# EAGLE board 4high (EAGLE 6.6.0), part 1 of 2
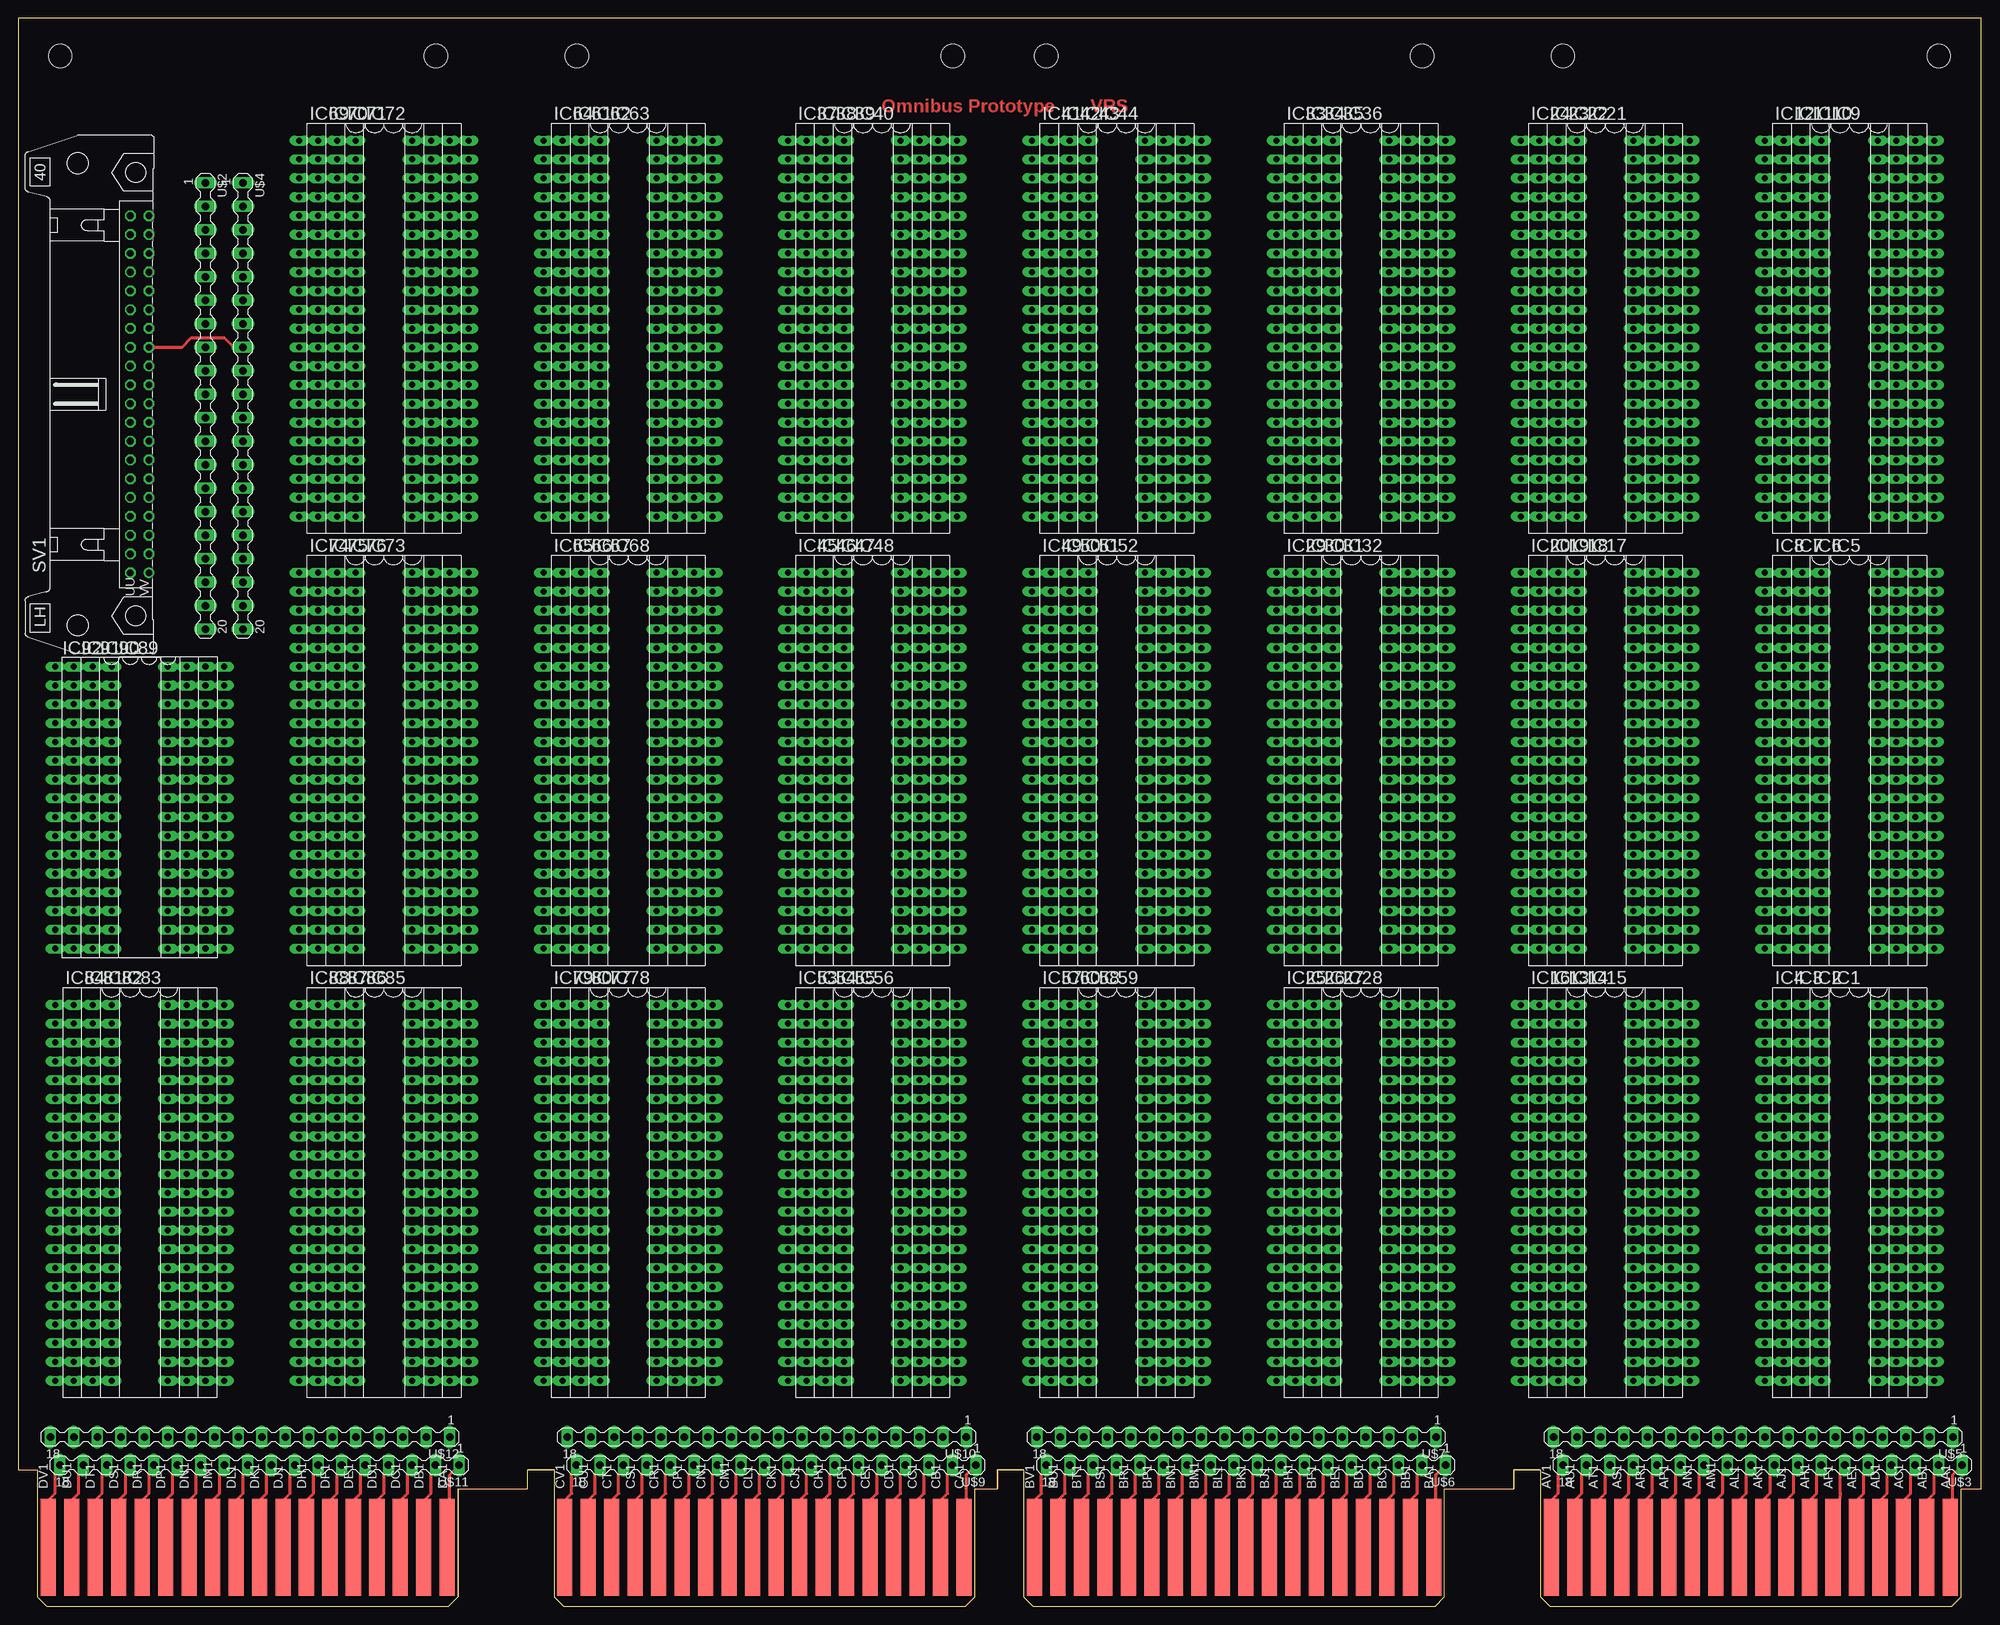
[diagram p1: board, top side]
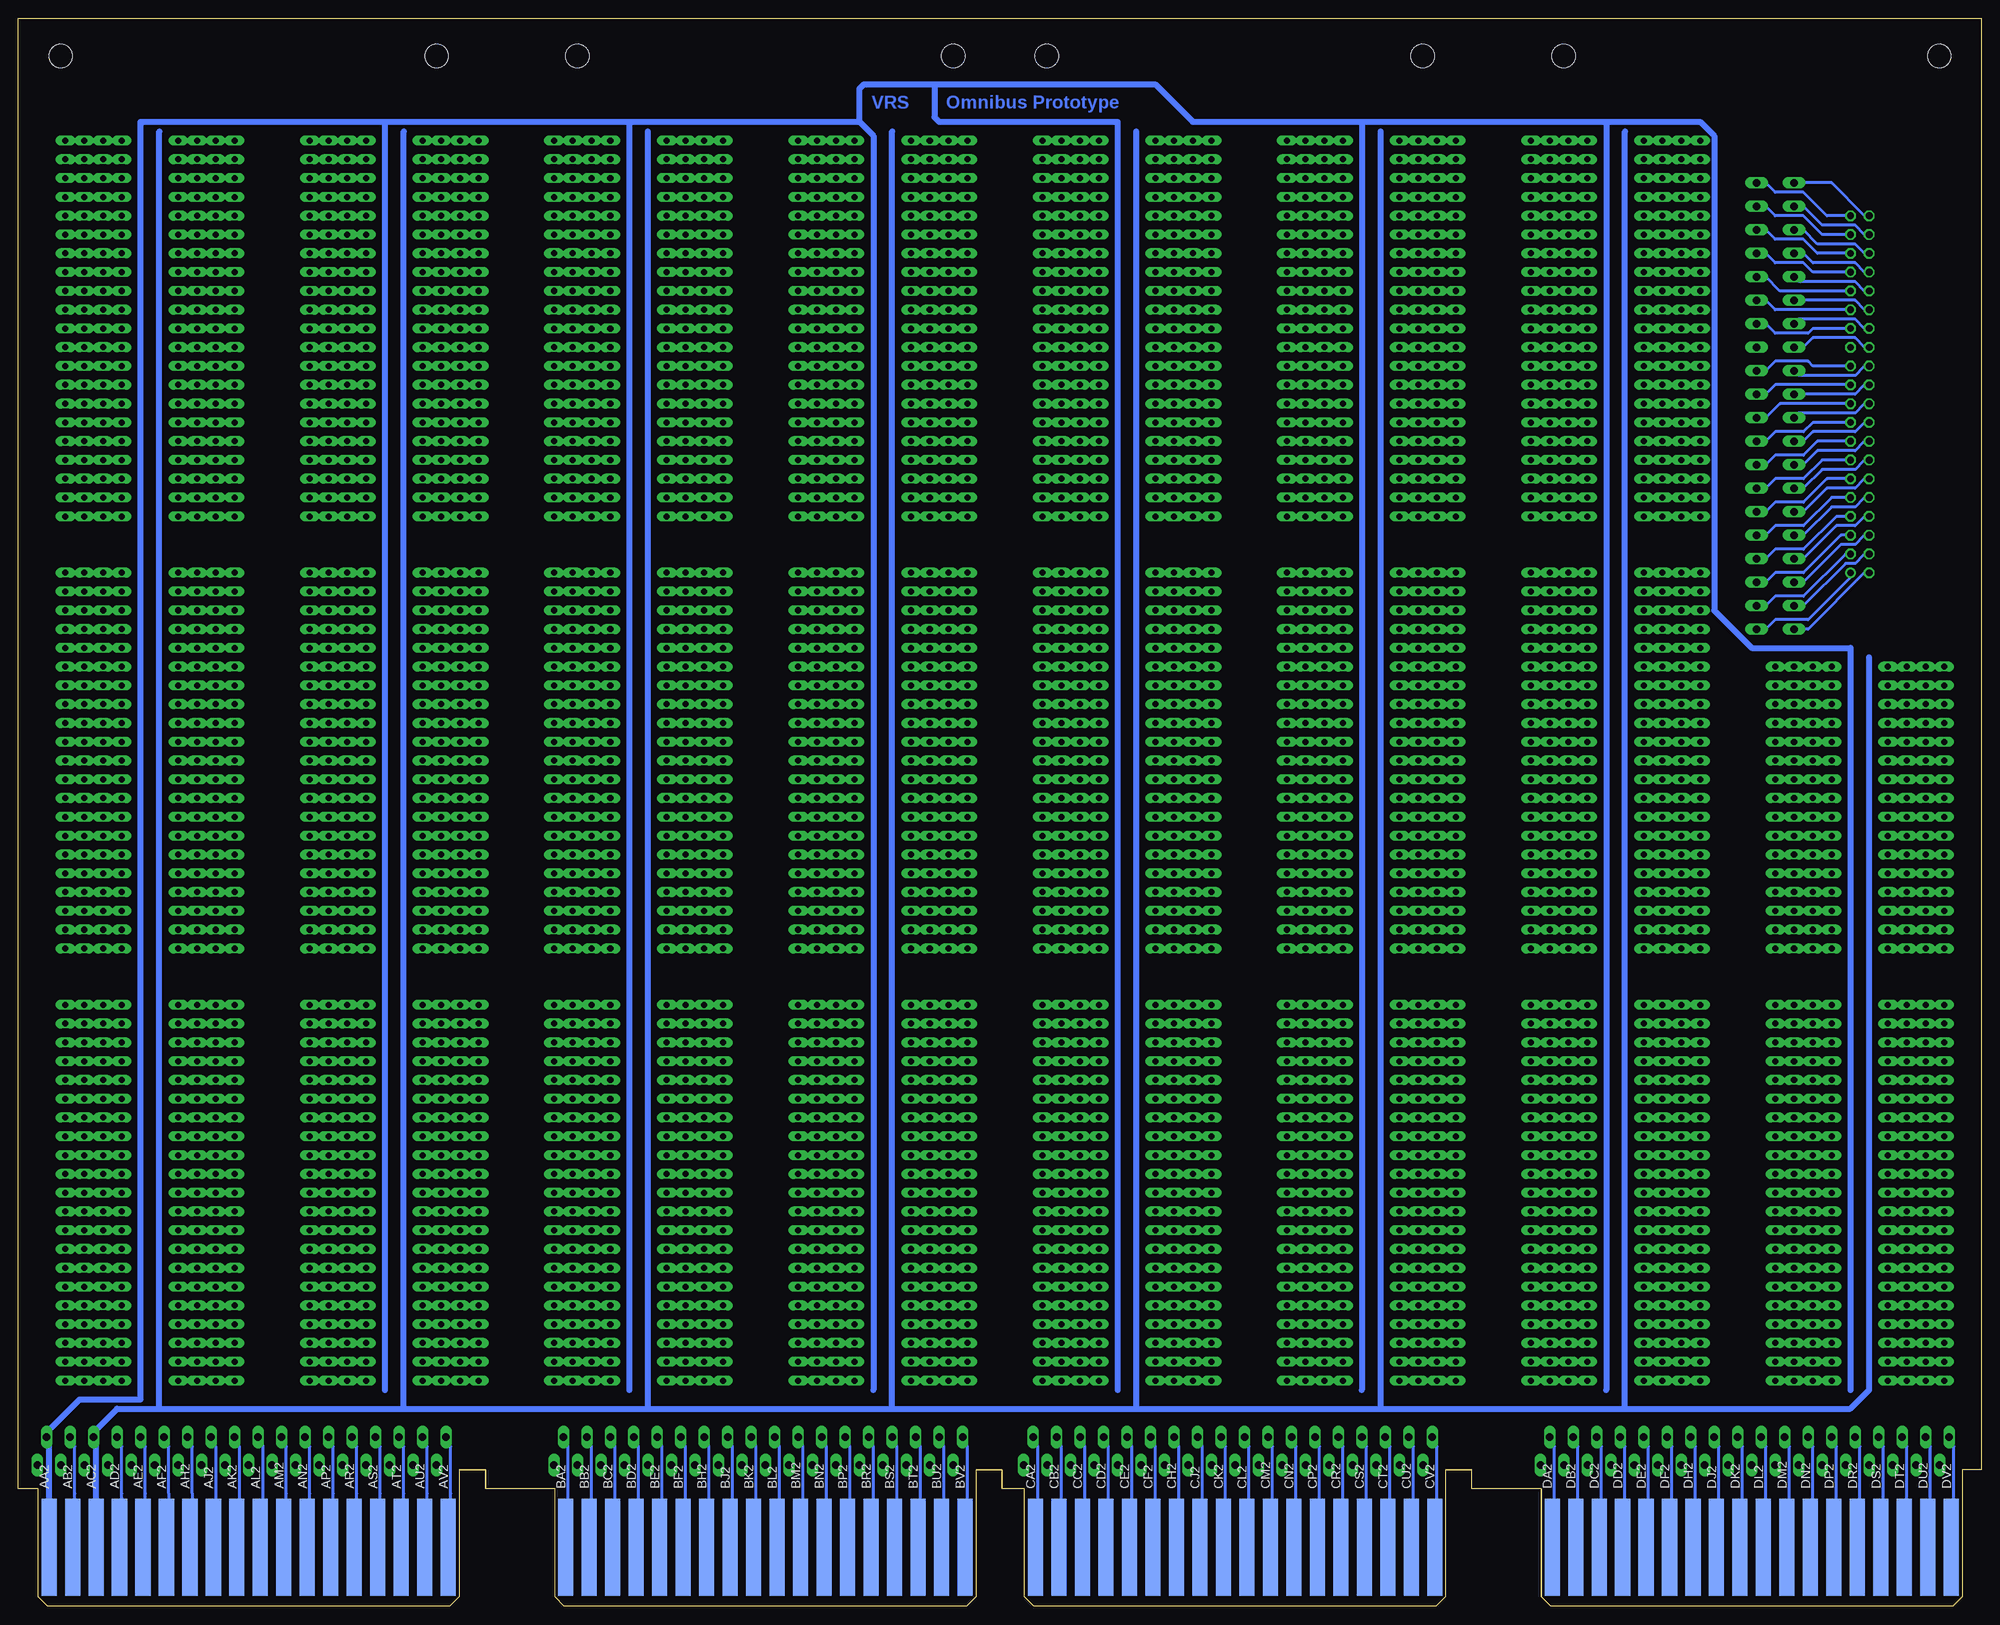
[diagram p2: board, bottom side, seen from below]

Size 265.3 x 214.63 mm. Coordinates in mm from the lower left corner, seen from the top.
Copper layers (1+16): Top 0.035mm / dielectric 1.5mm / Bottom 0.035mm
Design rules "16mils": minimum track width 16mil, minimum drill 32mil, track to track 15mil, track to pad 10mil, pad to pad 10mil, via to via 10mil, smd to smd 10mil, copper to edge 13mil, drill to drill 10mil, minimum pad ring 10mil, minimum via ring 8mil, stop-mask expansion 0mil, vias tented up to drill 0mil, thermal gap 10mil
Net classes: 1 supply: width 0.508 mm

## Footprints (pad centres in the part's own frame; a part is rotated, then mirrored left to right if it is on the bottom)
DIL42 = drill 0.813 long: 1 -25.4,-7.62; 2 -22.86,-7.62; 3 -20.32,-7.62; 4 -17.78,-7.62; 5 -15.24,-7.62; 6 -12.7,-7.62; 7 -10.16,-7.62; 8 -7.62,-7.62; 9 -5.08,-7.62; 10 -2.54,-7.62; 11 0,-7.62; 12 2.54,-7.62; 13 5.08,-7.62; 14 7.62,-7.62; 15 10.16,-7.62; 16 12.7,-7.62; 17 15.24,-7.62; 18 17.78,-7.62; 19 20.32,-7.62; 20 22.86,-7.62; 21 25.4,-7.62; 22 25.4,7.62; 23 22.86,7.62; 24 20.32,7.62; 25 17.78,7.62; 26 15.24,7.62; 27 12.7,7.62; 28 10.16,7.62; 29 7.62,7.62; 30 5.08,7.62; 31 2.54,7.62; 32 0,7.62; 33 -2.54,7.62; 34 -5.08,7.62; 35 -7.62,7.62; 36 -10.16,7.62; 37 -12.7,7.62; 38 -15.24,7.62; 39 -17.78,7.62; 40 -20.32,7.62; 41 -22.86,7.62; 42 -25.4,7.62
DIL32 = drill 0.813 long: 1 -19.05,-7.62; 2 -16.51,-7.62; 3 -13.97,-7.62; 4 -11.43,-7.62; 5 -8.89,-7.62; 6 -6.35,-7.62; 7 -3.81,-7.62; 8 -1.27,-7.62; 9 1.27,-7.62; 10 3.81,-7.62; 11 6.35,-7.62; 12 8.89,-7.62; 13 11.43,-7.62; 14 13.97,-7.62; 15 16.51,-7.62; 16 19.05,-7.62; 17 19.05,7.62; 18 16.51,7.62; 19 13.97,7.62; 20 11.43,7.62; 21 8.89,7.62; 22 6.35,7.62; 23 3.81,7.62; 24 1.27,7.62; 25 -1.27,7.62; 26 -3.81,7.62; 27 -6.35,7.62; 28 -8.89,7.62; 29 -11.43,7.62; 30 -13.97,7.62; 31 -16.51,7.62; 32 -19.05,7.62
DEC40PINH = drill 0.914 octagon: A 24.13,1.27; AA -3.81,1.27; B 24.13,-1.27; BB -3.81,-1.27; C 21.59,1.27; CC -6.35,1.27; D 21.59,-1.27; DD -6.35,-1.27; E 19.05,1.27; EE -8.89,1.27; F 19.05,-1.27; FF -8.89,-1.27; H 16.51,1.27; HH -11.43,1.27; J 16.51,-1.27; JJ -11.43,-1.27; K 13.97,1.27; KK -13.97,1.27; L 13.97,-1.27; LL -13.97,-1.27; M 11.43,1.27; MM -16.51,1.27; N 11.43,-1.27; NN -16.51,-1.27; P 8.89,1.27; PP -19.05,1.27; R 8.89,-1.27; RR -19.05,-1.27; S 6.35,1.27; SS -21.59,1.27; T 6.35,-1.27; TT -21.59,-1.27; U 3.81,1.27; UU -24.13,1.27; V 3.81,-1.27; W 1.27,1.27; X 1.27,-1.27; Y -1.27,1.27; Z -1.27,-1.27 | drill 0.914: VV -24.13,-1.27
EDGE-CON8 = smd 2.032 x 13.106: AA1 261.303,7.938; AB1 258.127,7.938; AC1 254.952,7.938; AD1 251.778,7.938; AE1 248.602,7.938; AF1 245.428,7.938; AH1 242.252,7.938; AJ1 239.077,7.938; AK1 235.903,7.938; AL1 232.727,7.938; AM1 229.553,7.938; AN1 226.377,7.938; AP1 223.202,7.938; AR1 220.028,7.938; AS1 216.852,7.938; AT1 213.678,7.938; AU1 210.502,7.938; AV1 207.327,7.938; BA1 191.452,7.938; BB1 188.278,7.938; BC1 185.102,7.938; BD1 181.928,7.938; BE1 178.752,7.938; BF1 175.577,7.938; BH1 172.403,7.938; BJ1 169.227,7.938; BK1 166.053,7.938; BL1 162.877,7.938; BM1 159.702,7.938; BN1 156.528,7.938; BP1 153.352,7.938; BR1 150.178,7.938; BS1 147.002,7.938; BT1 143.827,7.938; BU1 140.653,7.938; BV1 137.477,7.938; CA1 127.953,7.938; CB1 124.778,7.938; CC1 121.603,7.938; CD1 118.427,7.938; CE1 115.252,7.938; CF1 112.078,7.938; CH1 108.903,7.938; CJ1 105.728,7.938; CK1 102.552,7.938; CL1 99.377,7.938; CM1 96.203,7.938; CN1 93.028,7.938; CP1 89.853,7.938; CR1 86.677,7.938; CS1 83.502,7.938; CT1 80.328,7.938; CU1 77.153,7.938; CV1 73.978,7.938; DA1 58.102,7.938; DB1 54.928,7.938; DC1 51.752,7.938; DD1 48.578,7.938; DE1 45.403,7.938; DF1 42.227,7.938; DH1 39.053,7.938; DJ1 35.877,7.938; DK1 32.703,7.938; DL1 29.527,7.938; DM1 26.352,7.938; DN1 23.177,7.938; DP1 20.003,7.938; DR1 16.828,7.938; DS1 13.652,7.938; DT1 10.477,7.938; DU1 7.303,7.938; DV1 4.128,7.938 | smd 2.032 x 13.106 bottom: AA2 261.303,7.938; AB2 258.127,7.938; AC2 254.952,7.938; AD2 251.778,7.938; AE2 248.602,7.938; AF2 245.428,7.938; AH2 242.252,7.938; AJ2 239.077,7.938; AK2 235.903,7.938; AL2 232.727,7.938; AM2 229.553,7.938; AN2 226.377,7.938; AP2 223.202,7.938; AR2 220.028,7.938; AS2 216.852,7.938; AT2 213.678,7.938; AU2 210.502,7.938; AV2 207.327,7.938; BA2 191.452,7.938; BB2 188.278,7.938; BC2 185.102,7.938; BD2 181.928,7.938; BE2 178.752,7.938; BF2 175.577,7.938; BH2 172.403,7.938; BJ2 169.227,7.938; BK2 166.053,7.938; BL2 162.877,7.938; BM2 159.702,7.938; BN2 156.528,7.938; BP2 153.352,7.938; BR2 150.178,7.938; BS2 147.002,7.938; BT2 143.827,7.938; BU2 140.653,7.938; BV2 137.477,7.938; CA2 127.953,7.938; CB2 124.778,7.938; CC2 121.603,7.938; CD2 118.427,7.938; CE2 115.252,7.938; CF2 112.078,7.938; CH2 108.903,7.938; CJ2 105.728,7.938; CK2 102.552,7.938; CL2 99.377,7.938; CM2 96.203,7.938; CN2 93.028,7.938; CP2 89.853,7.938; CR2 86.677,7.938; CS2 83.502,7.938; CT2 80.328,7.938; CU2 77.153,7.938; CV2 73.978,7.938; DA2 58.102,7.938; DB2 54.928,7.938; DC2 51.752,7.938; DD2 48.578,7.938; DE2 45.403,7.938; DF2 42.227,7.938; DH2 39.053,7.938; DJ2 35.877,7.938; DK2 32.703,7.938; DL2 29.527,7.938; DM2 26.352,7.938; DN2 23.177,7.938; DP2 20.003,7.938; DR2 16.828,7.938; DS2 13.652,7.938; DT2 10.477,7.938; DU2 7.303,7.938; DV2 4.128,7.938
MA20-1 = drill 1.016 long: 1 -28.575,0; 2 -25.4,0; 3 -22.225,0; 4 -19.05,0; 5 -15.875,0; 6 -12.7,0; 7 -9.525,0; 8 -6.35,0; 9 -3.175,0; 10 0,0; 11 3.175,0; 12 6.35,0; 13 9.525,0; 14 12.7,0; 15 15.875,0; 16 19.05,0; 17 22.225,0; 18 25.4,0; 19 28.575,0; 20 31.75,0
MA18-1 = drill 1.016 long: 1 -25.4,0; 2 -22.225,0; 3 -19.05,0; 4 -15.875,0; 5 -12.7,0; 6 -9.525,0; 7 -6.35,0; 8 -3.175,0; 9 0,0; 10 3.175,0; 11 6.35,0; 12 9.525,0; 13 12.7,0; 14 15.875,0; 15 19.05,0; 16 22.225,0; 17 25.4,0; 18 28.575,0
OMNIBUS = hole 3.175: 208.915,209.55; 259.715,209.55; 189.865,209.55; 139.065,209.55; 75.616,209.55; 126.416,209.55; 56.566,209.55; 5.766,209.55

## Placement (x,y rotation side)
IC1  [DIL42]  251.33,55.88 270 top
IC2  [DIL42]  248.79,55.88 270 top
IC3  [DIL42]  246.25,55.88 270 top
IC4  [DIL42]  243.71,55.88 270 top
IC5  [DIL42]  251.33,114.3 270 top
IC6  [DIL42]  248.79,114.3 270 top
IC7  [DIL42]  246.25,114.3 270 top
IC8  [DIL42]  243.71,114.3 270 top
IC9  [DIL42]  251.33,172.72 270 top
IC10  [DIL42]  248.79,172.72 270 top
IC11  [DIL42]  246.25,172.72 270 top
IC12  [DIL42]  243.71,172.72 270 top
IC13  [DIL42]  213.23,55.88 270 top
IC14  [DIL42]  215.77,55.88 270 top
IC15  [DIL42]  218.31,55.88 270 top
IC16  [DIL42]  210.69,55.88 270 top
IC17  [DIL42]  218.31,114.3 270 top
IC18  [DIL42]  215.77,114.3 270 top
IC19  [DIL42]  213.23,114.3 270 top
IC20  [DIL42]  210.69,114.3 270 top
IC21  [DIL42]  218.31,172.72 270 top
IC22  [DIL42]  215.77,172.72 270 top
IC23  [DIL42]  213.23,172.72 270 top
IC24  [DIL42]  210.69,172.72 270 top
IC25  [DIL42]  177.67,55.88 270 top
IC26  [DIL42]  180.21,55.88 270 top
IC27  [DIL42]  182.75,55.88 270 top
IC28  [DIL42]  185.29,55.88 270 top
IC29  [DIL42]  177.67,114.3 270 top
IC30  [DIL42]  180.21,114.3 270 top
IC31  [DIL42]  182.75,114.3 270 top
IC32  [DIL42]  185.29,114.3 270 top
IC33  [DIL42]  177.67,172.72 270 top
IC34  [DIL42]  180.21,172.72 270 top
IC35  [DIL42]  182.75,172.72 270 top
IC36  [DIL42]  185.29,172.72 270 top
IC37  [DIL42]  111.63,172.72 270 top
IC38  [DIL42]  114.17,172.72 270 top
IC39  [DIL42]  116.71,172.72 270 top
IC40  [DIL42]  119.25,172.72 270 top
IC41  [DIL42]  144.65,172.72 270 top
IC42  [DIL42]  147.19,172.72 270 top
IC43  [DIL42]  149.73,172.72 270 top
IC44  [DIL42]  152.27,172.72 270 top
IC45  [DIL42]  111.63,114.3 270 top
IC46  [DIL42]  114.17,114.3 270 top
IC47  [DIL42]  116.71,114.3 270 top
IC48  [DIL42]  119.25,114.3 270 top
IC49  [DIL42]  144.65,114.3 270 top
IC50  [DIL42]  147.19,114.3 270 top
IC51  [DIL42]  149.73,114.3 270 top
IC52  [DIL42]  152.27,114.3 270 top
IC53  [DIL42]  111.63,55.88 270 top
IC54  [DIL42]  114.17,55.88 270 top
IC55  [DIL42]  116.71,55.88 270 top
IC56  [DIL42]  119.25,55.88 270 top
IC57  [DIL42]  144.65,55.88 270 top
IC58  [DIL42]  149.73,55.88 270 top
IC59  [DIL42]  152.27,55.88 270 top
IC60  [DIL42]  147.19,55.88 270 top
IC61  [DIL42]  81.15,172.72 270 top
IC62  [DIL42]  83.69,172.72 270 top
IC63  [DIL42]  86.23,172.72 270 top
IC64  [DIL42]  78.61,172.72 270 top
IC65  [DIL42]  78.61,114.3 270 top
IC66  [DIL42]  81.15,114.3 270 top
IC67  [DIL42]  83.69,114.3 270 top
IC68  [DIL42]  86.23,114.3 270 top
IC69  [DIL42]  45.59,172.72 270 top
IC70  [DIL42]  48.13,172.72 270 top
IC71  [DIL42]  50.67,172.72 270 top
IC72  [DIL42]  53.21,172.72 270 top
IC73  [DIL42]  53.21,114.3 270 top
IC74  [DIL42]  45.59,114.3 270 top
IC75  [DIL42]  48.13,114.3 270 top
IC76  [DIL42]  50.67,114.3 270 top
IC77  [DIL42]  83.69,55.88 270 top
IC78  [DIL42]  86.23,55.88 270 top
IC79  [DIL42]  78.61,55.88 270 top
IC80  [DIL42]  81.15,55.88 270 top
IC81  [DIL42]  15.11,55.88 270 top
IC82  [DIL42]  17.65,55.88 270 top
IC83  [DIL42]  20.19,55.88 270 top
IC84  [DIL42]  12.57,55.88 270 top
IC85  [DIL42]  53.21,55.88 270 top
IC86  [DIL42]  50.67,55.88 270 top
IC87  [DIL42]  48.13,55.88 270 top
IC88  [DIL42]  45.59,55.88 270 top
IC89  [DIL32]  20.19,107.95 270 top
IC90  [DIL32]  17.65,107.95 270 top
IC91  [DIL32]  15.11,107.95 270 top
IC92  [DIL32]  12.57,107.95 270 top
SV1  [DEC40PINH]  16.38,163.83 90 top
U$1  [EDGE-CON8]  -0.13,0 0 top
U$2  MA20-1  [MA20-1]  25.27,163.83 270 top
U$3  MA18-1  [MA18-1]  237.36,19.05 180 top
U$4  MA20-1  [MA20-1]  30.35,163.83 270 top
U$5  MA18-1  [MA18-1]  236.09,22.86 180 top
U$6  MA18-1  [MA18-1]  167.51,19.05 180 top
U$7  MA18-1  [MA18-1]  166.24,22.86 180 top
U$8  OUTLINE-OMNIBUS  [OMNIBUS]  -0.13,0 0 top
U$9  MA18-1  [MA18-1]  104.01,19.05 180 top
U$10  MA18-1  [MA18-1]  102.74,22.86 180 top
U$11  MA18-1  [MA18-1]  34.16,19.05 180 top
U$12  MA18-1  [MA18-1]  32.89,22.86 180 top

## Tracks (layer width: path | path; a pad name or v marks a point on that pad's centre or on a via)
GND
  Bottom 0.813: U$1.AC2 254.82,21.59 U$5.3 254.51,24.13 251.97,26.67 246.25,26.67 | 15.11,128.27 15.11,29.21 17.65,26.67 48.13,26.67 | 48.13,26.67 48.13,199.39 | 81.15,26.67 81.15,199.39 | 114.17,26.67 114.17,199.39 | 147.19,26.67 147.19,199.39 | 180.21,26.67 180.21,199.39 | 213.23,26.67 213.23,199.39 | 246.25,26.67 246.25,199.39 | 81.15,26.67 48.13,26.67 | 114.17,26.67 81.15,26.67 | 246.25,26.67 213.23,26.67 | 213.23,26.67 180.21,26.67 | 180.21,26.67 147.19,26.67 | 147.19,26.67 114.17,26.67
N$1
  Bottom 0.406: IC4.1 IC3.1 IC2.1 IC1.1
N$2
  Bottom 0.406: IC4.2 IC3.2 IC2.2 IC1.2
N$3
  Bottom 0.406: IC4.3 IC3.3 IC2.3 IC1.3
N$4
  Bottom 0.406: IC4.4 IC3.4 IC2.4 IC1.4
N$5
  Bottom 0.406: IC4.5 IC3.5 IC2.5 IC1.5
N$6
  Bottom 0.406: IC4.6 IC3.6 IC2.6 IC1.6
N$7
  Bottom 0.406: IC4.7 IC3.7 IC2.7 IC1.7
N$8
  Bottom 0.406: IC4.8 IC3.8 IC2.8 IC1.8
N$9
  Bottom 0.406: IC4.9 IC3.9 IC2.9 IC1.9
N$10
  Bottom 0.406: IC4.10 IC3.10 IC2.10 IC1.10
N$11
  Bottom 0.406: IC4.11 IC3.11 IC2.11 IC1.11
N$12
  Bottom 0.406: IC4.12 IC3.12 IC2.12 IC1.12
N$13
  Bottom 0.406: IC4.13 IC3.13 IC2.13 IC1.13
N$14
  Bottom 0.406: IC4.14 IC3.14 IC2.14 IC1.14
N$15
  Bottom 0.406: IC4.15 IC3.15 IC2.15 IC1.15
N$16
  Bottom 0.406: IC4.16 IC3.16 IC2.16 IC1.16
N$17
  Bottom 0.406: IC4.17 IC3.17 IC2.17 IC1.17
N$18
  Bottom 0.406: IC4.18 IC3.18 IC2.18 IC1.18
N$19
  Bottom 0.406: IC4.19 IC3.19 IC2.19 IC1.19
N$20
  Bottom 0.406: IC4.20 IC3.20 IC2.20 IC1.20
N$21
  Bottom 0.406: IC4.21 IC3.21 IC2.21 IC1.21
N$22
  Bottom 0.406: IC4.22 IC3.22 IC2.22 IC1.22
N$23
  Bottom 0.406: IC4.23 IC3.23 IC2.23 IC1.23
N$24
  Bottom 0.406: IC4.24 IC3.24 IC2.24 IC1.24
N$25
  Bottom 0.406: IC4.25 IC3.25 IC2.25 IC1.25
N$26
  Bottom 0.406: IC4.26 IC3.26 IC2.26 IC1.26
N$27
  Bottom 0.406: IC4.27 IC3.27 IC2.27 IC1.27
N$28
  Bottom 0.406: IC4.28 IC3.28 IC2.28 IC1.28
N$29
  Bottom 0.406: IC4.29 IC3.29 IC2.29 IC1.29
N$30
  Bottom 0.406: IC4.30 IC3.30 IC2.30 IC1.30
N$31
  Bottom 0.406: IC4.31 IC3.31 IC2.31 IC1.31
N$32
  Bottom 0.406: IC4.32 IC3.32 IC2.32 IC1.32
N$33
  Bottom 0.406: IC4.33 IC3.33 IC2.33 IC1.33
N$34
  Bottom 0.406: IC4.34 IC3.34 IC2.34 IC1.34
N$35
  Bottom 0.406: IC4.35 IC3.35 IC2.35 IC1.35
N$36
  Bottom 0.406: IC4.36 IC3.36 IC2.36 IC1.36
N$37
  Bottom 0.406: IC4.37 IC3.37 IC2.37 IC1.37
N$38
  Bottom 0.406: IC4.38 IC3.38 IC2.38 IC1.38
N$39
  Bottom 0.406: IC4.39 IC3.39 IC2.39 IC1.39
N$40
  Bottom 0.406: IC4.40 IC3.40 IC2.40 IC1.40
N$41
  Bottom 0.406: IC4.41 IC3.41 IC2.41 IC1.41
N$42
  Bottom 0.406: IC4.42 IC3.42 IC2.42 IC1.42
N$43
  Bottom 0.406: IC8.1 IC7.1 IC6.1 IC5.1
N$44
  Bottom 0.406: IC8.2 IC7.2 IC6.2 IC5.2
N$45
  Bottom 0.406: IC8.3 IC7.3 IC6.3 IC5.3
N$46
  Bottom 0.406: IC8.4 IC7.4 IC6.4 IC5.4
N$47
  Bottom 0.406: IC8.5 IC7.5 IC6.5 IC5.5
N$48
  Bottom 0.406: IC8.6 IC7.6 IC6.6 IC5.6
N$49
  Bottom 0.406: IC8.7 IC7.7 IC6.7 IC5.7
N$50
  Bottom 0.406: IC8.8 IC7.8 IC6.8 IC5.8
N$51
  Bottom 0.406: IC8.9 IC7.9 IC6.9 IC5.9
N$52
  Bottom 0.406: IC8.10 IC7.10 IC6.10 IC5.10
N$53
  Bottom 0.406: IC8.11 IC7.11 IC6.11 IC5.11
N$54
  Bottom 0.406: IC8.12 IC7.12 IC6.12 IC5.12
N$55
  Bottom 0.406: IC8.13 IC7.13 IC6.13 IC5.13
N$56
  Bottom 0.406: IC8.14 IC7.14 IC6.14 IC5.14
N$57
  Bottom 0.406: IC8.15 IC7.15 IC6.15 IC5.15
N$58
  Bottom 0.406: IC8.16 IC7.16 IC6.16 IC5.16
N$59
  Bottom 0.406: IC8.17 IC7.17 IC6.17 IC5.17
N$60
  Bottom 0.406: IC8.18 IC7.18 IC6.18 IC5.18
N$61
  Bottom 0.406: IC8.19 IC7.19 IC6.19 IC5.19
N$62
  Bottom 0.406: IC8.20 IC7.20 IC6.20 IC5.20
N$63
  Bottom 0.406: IC8.21 IC7.21 IC6.21 IC5.21
N$64
  Bottom 0.406: IC8.22 IC7.22 IC6.22 IC5.22
N$65
  Bottom 0.406: IC8.23 IC7.23 IC6.23 IC5.23
N$66
  Bottom 0.406: IC8.24 IC7.24 IC6.24 IC5.24
N$67
  Bottom 0.406: IC8.25 IC7.25 IC6.25 IC5.25
N$68
  Bottom 0.406: IC8.26 IC7.26 IC6.26 IC5.26
N$69
  Bottom 0.406: IC8.27 IC7.27 IC6.27 IC5.27
N$70
  Bottom 0.406: IC8.28 IC7.28 IC6.28 IC5.28
N$71
  Bottom 0.406: IC8.29 IC7.29 IC6.29 IC5.29
N$72
  Bottom 0.406: IC8.30 IC7.30 IC6.30 IC5.30
N$73
  Bottom 0.406: IC8.31 IC7.31 IC6.31 IC5.31
N$74
  Bottom 0.406: IC8.32 IC7.32 IC6.32 IC5.32
N$75
  Bottom 0.406: IC8.33 IC7.33 IC6.33 IC5.33
N$76
  Bottom 0.406: IC8.34 IC7.34 IC6.34 IC5.34
N$77
  Bottom 0.406: IC8.35 IC7.35 IC6.35 IC5.35
N$78
  Bottom 0.406: IC8.36 IC7.36 IC6.36 IC5.36
N$79
  Bottom 0.406: IC8.37 IC7.37 IC6.37 IC5.37
N$80
  Bottom 0.406: IC8.38 IC7.38 IC6.38 IC5.38
N$81
  Bottom 0.406: IC8.39 IC7.39 IC6.39 IC5.39
N$82
  Bottom 0.406: IC8.40 IC7.40 IC6.40 IC5.40
N$83
  Bottom 0.406: IC8.41 IC7.41 IC6.41 IC5.41
N$84
  Bottom 0.406: IC8.42 IC7.42 IC6.42 IC5.42
N$85
  Bottom 0.406: IC12.1 IC11.1 IC10.1 IC9.1
N$86
  Bottom 0.406: IC12.2 IC11.2 IC10.2 IC9.2
N$87
  Bottom 0.406: IC12.3 IC11.3 IC10.3 IC9.3
N$88
  Bottom 0.406: IC12.4 IC11.4 IC10.4 IC9.4
N$89
  Bottom 0.406: IC12.5 IC11.5 IC10.5 IC9.5
N$90
  Bottom 0.406: IC12.6 IC11.6 IC10.6 IC9.6
N$91
  Bottom 0.406: IC12.7 IC11.7 IC10.7 IC9.7
N$92
  Bottom 0.406: IC12.8 IC11.8 IC10.8 IC9.8
N$93
  Bottom 0.406: IC12.9 IC11.9 IC10.9 IC9.9
N$94
  Bottom 0.406: IC12.10 IC11.10 IC10.10 IC9.10
N$95
  Bottom 0.406: IC12.11 IC11.11 IC10.11 IC9.11
N$96
  Bottom 0.406: IC12.12 IC11.12 IC10.12 IC9.12
N$97
  Bottom 0.406: IC12.13 IC11.13 IC10.13 IC9.13
N$98
  Bottom 0.406: IC12.14 IC11.14 IC10.14 IC9.14
N$99
  Bottom 0.406: IC12.15 IC11.15 IC10.15 IC9.15
N$100
  Bottom 0.406: IC12.16 IC11.16 IC10.16 IC9.16
N$101
  Bottom 0.406: IC12.17 IC11.17 IC10.17 IC9.17
N$102
  Bottom 0.406: IC12.18 IC11.18 IC10.18 IC9.18
N$103
  Bottom 0.406: IC12.19 IC11.19 IC10.19 IC9.19
N$104
  Bottom 0.406: IC12.20 IC11.20 IC10.20 IC9.20
N$105
  Bottom 0.406: IC12.21 IC11.21 IC10.21 IC9.21
N$106
  Bottom 0.406: IC12.22 IC11.22 IC10.22 IC9.22
N$107
  Bottom 0.406: IC12.23 IC11.23 IC10.23 IC9.23
N$108
  Bottom 0.406: IC12.24 IC11.24 IC10.24 IC9.24
N$109
  Bottom 0.406: IC12.25 IC11.25 IC10.25 IC9.25
N$110
  Bottom 0.406: IC12.26 IC11.26 IC10.26 IC9.26
N$111
  Bottom 0.406: IC12.27 IC11.27 IC10.27 IC9.27
N$112
  Bottom 0.406: IC12.28 IC11.28 IC10.28 IC9.28
N$113
  Bottom 0.406: IC12.29 IC11.29 IC10.29 IC9.29
N$114
  Bottom 0.406: IC12.30 IC11.30 IC10.30 IC9.30
N$115
  Bottom 0.406: IC12.31 IC11.31 IC10.31 IC9.31
N$116
  Bottom 0.406: IC12.32 IC11.32 IC10.32 IC9.32
N$117
  Bottom 0.406: IC12.33 IC11.33 IC10.33 IC9.33
N$118
  Bottom 0.406: IC12.34 IC11.34 IC10.34 IC9.34
N$119
  Bottom 0.406: IC12.35 IC11.35 IC10.35 IC9.35
N$120
  Bottom 0.406: IC12.36 IC11.36 IC10.36 IC9.36
N$121
  Bottom 0.406: IC12.37 IC11.37 IC10.37 IC9.37
N$122
  Bottom 0.406: IC12.38 IC11.38 IC10.38 IC9.38
N$123
  Bottom 0.406: IC12.39 IC11.39 IC10.39 IC9.39
N$124
  Bottom 0.406: IC12.40 IC11.40 IC10.40 IC9.40
N$125
  Bottom 0.406: IC12.41 IC11.41 IC10.41 IC9.41
N$126
  Bottom 0.406: IC12.42 IC11.42 IC10.42 IC9.42
N$127
  Bottom 0.406: IC16.1 IC13.1 IC14.1 IC15.1
N$128
  Bottom 0.406: IC16.2 IC13.2 IC14.2 IC15.2
N$129
  Bottom 0.406: IC16.3 IC13.3 IC14.3 IC15.3
N$130
  Bottom 0.406: IC16.4 IC13.4 IC14.4 IC15.4
N$131
  Bottom 0.406: IC16.5 IC13.5 IC14.5 IC15.5
N$132
  Bottom 0.406: IC16.6 IC13.6 IC14.6 IC15.6
N$133
  Bottom 0.406: IC16.7 IC13.7 IC14.7 IC15.7
N$134
  Bottom 0.406: IC16.8 IC13.8 IC14.8 IC15.8
N$135
  Bottom 0.406: IC16.9 IC13.9 IC14.9 IC15.9
N$136
  Bottom 0.406: IC16.10 IC13.10 IC14.10 IC15.10
N$137
  Bottom 0.406: IC16.11 IC13.11 IC14.11 IC15.11
N$138
  Bottom 0.406: IC16.12 IC13.12 IC14.12 IC15.12
N$139
  Bottom 0.406: IC16.13 IC13.13 IC14.13 IC15.13
N$140
  Bottom 0.406: IC16.14 IC13.14 IC14.14 IC15.14
N$141
  Bottom 0.406: IC16.15 IC13.15 IC14.15 IC15.15
N$142
  Bottom 0.406: IC16.16 IC13.16 IC14.16 IC15.16
N$143
  Bottom 0.406: IC16.17 IC13.17 IC14.17 IC15.17
N$144
  Bottom 0.406: IC16.18 IC13.18 IC14.18 IC15.18
N$145
  Bottom 0.406: IC16.19 IC13.19 IC14.19 IC15.19
N$146
  Bottom 0.406: IC16.20 IC13.20 IC14.20 IC15.20
N$147
  Bottom 0.406: IC16.21 IC13.21 IC14.21 IC15.21
N$148
  Bottom 0.406: IC16.22 IC13.22 IC14.22 IC15.22
N$149
  Bottom 0.406: IC16.23 IC13.23 IC14.23 IC15.23
N$150
  Bottom 0.406: IC16.24 IC13.24 IC14.24 IC15.24
N$151
  Bottom 0.406: IC16.25 IC13.25 IC14.25 IC15.25
N$152
  Bottom 0.406: IC16.26 IC13.26 IC14.26 IC15.26
N$153
  Bottom 0.406: IC16.27 IC13.27 IC14.27 IC15.27
N$154
  Bottom 0.406: IC16.28 IC13.28 IC14.28 IC15.28
N$155
  Bottom 0.406: IC16.29 IC13.29 IC14.29 IC15.29
N$156
  Bottom 0.406: IC16.30 IC13.30 IC14.30 IC15.30
N$157
  Bottom 0.406: IC16.31 IC13.31 IC14.31 IC15.31
N$158
  Bottom 0.406: IC16.32 IC13.32 IC14.32 IC15.32
N$159
  Bottom 0.406: IC16.33 IC13.33 IC14.33 IC15.33
N$160
  Bottom 0.406: IC16.34 IC13.34 IC14.34 IC15.34
N$161
  Bottom 0.406: IC16.35 IC13.35 IC14.35 IC15.35
N$162
  Bottom 0.406: IC16.36 IC13.36 IC14.36 IC15.36
N$163
  Bottom 0.406: IC16.37 IC13.37 IC14.37 IC15.37
N$164
  Bottom 0.406: IC16.38 IC13.38 IC14.38 IC15.38
N$165
  Bottom 0.406: IC16.39 IC13.39 IC14.39 IC15.39
N$166
  Bottom 0.406: IC16.40 IC13.40 IC14.40 IC15.40
N$167
  Bottom 0.406: IC16.41 IC13.41 IC14.41 IC15.41
N$168
  Bottom 0.406: IC16.42 IC13.42 IC14.42 IC15.42
N$169
  Top 0.406: U$3.9 236.73,17.78 236.73,15.24 235.46,13.97 U$1.AK1
N$170
  Top 0.406: U$3.10 233.55,17.78 233.55,15.24 232.28,13.97 U$1.AL1
N$171
  Top 0.406: U$3.11 230.38,17.78 230.38,15.24 229.11,13.97 U$1.AM1
N$172
  Top 0.406: U$3.12 227.2,17.78 227.2,15.24 225.93,13.97 U$1.AN1
N$173
  Top 0.406: U$3.13 224.03,17.78 224.03,15.24 222.76,13.97 U$1.AP1
N$174
  Top 0.406: U$3.14 220.85,17.78 220.85,15.24 219.58,13.97 U$1.AR1
N$175
  Top 0.406: U$3.15 217.68,17.78 217.68,15.24 216.41,13.97 U$1.AS1
N$176
  Top 0.406: U$3.16 214.5,17.78 214.5,15.24 213.23,13.97 U$1.AT1
N$177
  Top 0.406: U$3.17 211.33,17.78 211.33,15.24 210.06,13.97 U$1.AU1
N$178
  Top 0.406: U$3.18 208.15,17.78 208.15,15.24 206.88,13.97 U$1.AV1
N$179
  Top 0.406: U$3.8 239.9,17.78 239.9,15.24 238.63,13.97 U$1.AJ1
N$180
  Top 0.406: U$3.7 243.08,17.78 243.08,15.24 241.81,13.97 U$1.AH1
N$181
  Top 0.406: U$3.6 246.25,17.78 246.25,15.24 U$1.AF1
N$182
  Top 0.406: U$3.5 249.43,17.78 249.43,15.24 248.16,13.97 U$1.AE1
N$183
  Top 0.406: U$3.4 252.6,17.78 252.6,15.24 251.33,13.97 U$1.AD1
N$184
  Top 0.406: U$3.3 255.78,17.78 255.78,15.24 254.51,13.97 U$1.AC1
N$185
  Top 0.406: U$3.2 258.95,17.78 258.95,15.24 257.68,13.97 U$1.AB1
N$186
  Top 0.406: U$3.1 261.49,17.78 261.49,13.97 U$1.AA1
N$187
  Bottom 0.406: U$5.10 232.28,21.59 232.28,15.24 232.28,14.61 U$1.AL2
N$188
  Bottom 0.406: U$5.11 229.11,21.59 229.11,15.24 229.11,13.97 U$1.AM2
N$189
  Bottom 0.406: U$5.12 225.93,21.59 225.93,15.24 225.93,13.97 U$1.AN2
N$190
  Bottom 0.406: U$5.13 222.76,21.59 222.76,15.24 222.76,13.97 U$1.AP2
N$191
  Bottom 0.406: U$5.14 219.58,21.59 219.58,15.24 219.58,13.97 U$1.AR2
N$192
  Bottom 0.406: U$5.15 216.41,21.59 216.41,15.24 216.41,13.97 U$1.AS2
N$193
  Bottom 0.406: U$5.16 213.23,21.59 213.23,15.24 213.23,13.97 U$1.AT2
N$194
  Bottom 0.406: U$5.9 235.46,21.59 235.46,15.24 235.46,13.97 U$1.AK2
N$195
  Bottom 0.406: U$5.8 238.63,21.59 238.63,15.24 238.63,13.97 U$1.AJ2
N$196
  Bottom 0.406: U$5.7 241.81,21.59 241.81,15.24 241.81,13.97 U$1.AH2
N$197
  Bottom 0.406: U$5.6 244.98,21.59 244.98,15.24 244.98,13.97 U$1.AF2
N$198
  Bottom 0.406: U$5.5 248.16,21.59 248.16,15.24 U$1.AE2
N$199
  Bottom 0.406: U$5.4 251.33,21.59 251.33,15.24 251.33,14.61 U$1.AD2
N$200
  Bottom 0.406: IC20.1 IC19.1 IC18.1 IC17.1
N$201
  Bottom 0.406: U$5.17 210.06,21.59 210.06,15.24 210.06,13.97 U$1.AU2
N$202
  Bottom 0.406: U$5.18 206.88,21.59 206.88,15.24 206.88,13.97 U$1.AV2
N$203
  Bottom 0.406: U$5.2 257.68,21.59 257.68,15.24 257.68,13.97 U$1.AB2
N$204
  Bottom 0.406: IC20.2 IC19.2 IC18.2 IC17.2
N$205
  Bottom 0.406: IC20.3 IC19.3 IC18.3 IC17.3
N$206
  Bottom 0.406: IC20.4 IC19.4 IC18.4 IC17.4
N$207
  Bottom 0.406: IC20.5 IC19.5 IC18.5 IC17.5
N$208
  Bottom 0.406: IC20.6 IC19.6 IC18.6 IC17.6
N$209
  Bottom 0.406: IC20.7 IC19.7 IC18.7 IC17.7
N$210
  Bottom 0.406: IC20.8 IC19.8 IC18.8 IC17.8
N$211
  Bottom 0.406: IC20.9 IC19.9 IC18.9 IC17.9
N$212
  Bottom 0.406: IC20.10 IC19.10 IC18.10 IC17.10
N$213
  Bottom 0.406: IC20.11 IC19.11 IC18.11 IC17.11
N$214
  Bottom 0.406: IC20.12 IC19.12 IC18.12 IC17.12
N$215
  Bottom 0.406: IC20.13 IC19.13 IC18.13 IC17.13
N$216
  Bottom 0.406: IC20.14 IC19.14 IC18.14 IC17.14
N$217
  Bottom 0.406: IC20.15 IC19.15 IC18.15 IC17.15
N$218
  Bottom 0.406: IC20.16 IC19.16 IC18.16 IC17.16
N$219
  Bottom 0.406: IC20.17 IC19.17 IC18.17 IC17.17
N$220
  Bottom 0.406: IC20.18 IC19.18 IC18.18 IC17.18
N$221
  Bottom 0.406: IC20.19 IC19.19 IC18.19 IC17.19
N$222
  Bottom 0.406: IC20.20 IC19.20 IC18.20 IC17.20
N$223
  Bottom 0.406: IC20.21 IC19.21 IC18.21 IC17.21
N$224
  Bottom 0.406: IC20.22 IC19.22 IC18.22 IC17.22
N$225
  Bottom 0.406: IC20.23 IC19.23 IC18.23 IC17.23
N$226
  Bottom 0.406: IC20.24 IC19.24 IC18.24 IC17.24
N$227
  Bottom 0.406: IC20.25 IC19.25 IC18.25 IC17.25
N$228
  Bottom 0.406: IC20.26 IC19.26 IC18.26 IC17.26
N$229
  Bottom 0.406: IC20.27 IC19.27 IC18.27 IC17.27
N$230
  Bottom 0.406: IC20.28 IC19.28 IC18.28 IC17.28
N$231
  Bottom 0.406: IC20.29 IC19.29 IC18.29 IC17.29
N$232
  Bottom 0.406: IC20.30 IC19.30 IC18.30 IC17.30
N$233
  Bottom 0.406: IC20.31 IC19.31 IC18.31 IC17.31
N$234
  Bottom 0.406: IC20.32 IC19.32 IC18.32 IC17.32
N$235
  Bottom 0.406: IC20.33 IC19.33 IC18.33 IC17.33
N$236
  Bottom 0.406: IC20.34 IC19.34 IC18.34 IC17.34
N$237
  Bottom 0.406: IC20.35 IC19.35 IC18.35 IC17.35
N$238
  Bottom 0.406: IC20.36 IC19.36 IC18.36 IC17.36
N$239
  Bottom 0.406: IC20.37 IC19.37 IC18.37 IC17.37
N$240
  Bottom 0.406: IC20.38 IC19.38 IC18.38 IC17.38
N$241
  Bottom 0.406: IC20.39 IC19.39 IC18.39 IC17.39
N$242
  Bottom 0.406: IC20.40 IC19.40 IC18.40 IC17.40
N$243
  Bottom 0.406: IC20.41 IC19.41 IC18.41 IC17.41
N$244
  Bottom 0.406: IC20.42 IC19.42 IC18.42 IC17.42
N$245
  Bottom 0.406: IC24.1 IC23.1 IC22.1 IC21.1
N$246
  Bottom 0.406: IC24.2 IC23.2 IC22.2 IC21.2
N$247
  Bottom 0.406: IC24.3 IC23.3 IC22.3 IC21.3
N$248
  Bottom 0.406: IC24.4 IC23.4 IC22.4 IC21.4
N$249
  Bottom 0.406: IC24.5 IC23.5 IC22.5 IC21.5
N$250
  Bottom 0.406: IC24.6 IC23.6 IC22.6 IC21.6
N$251
  Bottom 0.406: IC24.7 IC23.7 IC22.7 IC21.7
N$252
  Bottom 0.406: IC24.8 IC23.8 IC22.8 IC21.8
N$253
  Bottom 0.406: IC24.9 IC23.9 IC22.9 IC21.9
N$254
  Bottom 0.406: IC24.10 IC23.10 IC22.10 IC21.10
N$255
  Bottom 0.406: IC24.11 IC23.11 IC22.11 IC21.11
N$256
  Bottom 0.406: IC24.12 IC23.12 IC22.12 IC21.12
N$257
  Bottom 0.406: IC24.13 IC23.13 IC22.13 IC21.13
N$258
  Bottom 0.406: IC24.14 IC23.14 IC22.14 IC21.14
N$259
  Bottom 0.406: IC24.15 IC23.15 IC22.15 IC21.15
N$260
  Bottom 0.406: IC24.16 IC23.16 IC22.16 IC21.16
N$261
  Bottom 0.406: IC24.17 IC23.17 IC22.17 IC21.17
N$262
  Bottom 0.406: IC24.18 IC23.18 IC22.18 IC21.18
N$263
  Bottom 0.406: IC24.19 IC23.19 IC22.19 IC21.19
N$264
  Bottom 0.406: IC24.20 IC23.20 IC22.20 IC21.20
N$265
  Bottom 0.406: IC24.21 IC23.21 IC22.21 IC21.21
N$266
  Bottom 0.406: IC24.22 IC23.22 IC22.22 IC21.22
N$267
  Bottom 0.406: IC24.23 IC23.23 IC22.23 IC21.23
N$268
  Bottom 0.406: IC24.24 IC23.24 IC22.24 IC21.24
N$269
  Bottom 0.406: IC24.25 IC23.25 IC22.25 IC21.25
N$270
  Bottom 0.406: IC24.26 IC23.26 IC22.26 IC21.26
N$271
  Bottom 0.406: IC24.27 IC23.27 IC22.27 IC21.27
N$272
  Bottom 0.406: IC24.28 IC23.28 IC22.28 IC21.28
N$273
  Bottom 0.406: IC24.29 IC23.29 IC22.29 IC21.29
N$274
  Bottom 0.406: IC24.30 IC23.30 IC22.30 IC21.30
N$275
  Bottom 0.406: IC24.31 IC23.31 IC22.31 IC21.31
N$276
  Bottom 0.406: IC24.32 IC23.32 IC22.32 IC21.32
N$277
  Bottom 0.406: IC24.33 IC23.33 IC22.33 IC21.33
N$278
  Bottom 0.406: IC24.34 IC23.34 IC22.34 IC21.34
N$279
  Bottom 0.406: IC24.35 IC23.35 IC22.35 IC21.35
N$280
  Bottom 0.406: IC24.36 IC23.36 IC22.36 IC21.36
N$281
  Bottom 0.406: IC24.37 IC23.37 IC22.37 IC21.37
N$282
  Bottom 0.406: IC24.38 IC23.38 IC22.38 IC21.38
N$283
  Bottom 0.406: IC24.39 IC23.39 IC22.39 IC21.39
N$284
  Bottom 0.406: IC24.40 IC23.40 IC22.40 IC21.40
N$285
  Bottom 0.406: IC24.41 IC23.41 IC22.41 IC21.41
N$286
  Bottom 0.406: IC24.42 IC23.42 IC22.42 IC21.42
N$287
  Bottom 0.406: IC25.1 IC26.1 IC27.1 IC28.1
N$288
  Bottom 0.406: IC25.2 IC26.2 IC27.2 IC28.2
N$289
  Bottom 0.406: IC25.3 IC26.3 IC27.3 IC28.3
N$290
  Bottom 0.406: IC25.4 IC26.4 IC27.4 IC28.4
N$291
  Bottom 0.406: IC25.5 IC26.5 IC27.5 IC28.5
N$292
  Bottom 0.406: IC25.6 IC26.6 IC27.6 IC28.6
N$293
  Bottom 0.406: IC25.7 IC26.7 IC27.7 IC28.7
N$294
  Bottom 0.406: IC25.8 IC26.8 IC27.8 IC28.8
N$295
  Bottom 0.406: IC25.9 IC26.9 IC27.9 IC28.9
N$296
  Bottom 0.406: IC25.10 IC26.10 IC27.10 IC28.10
N$297
  Bottom 0.406: IC25.11 IC26.11 IC27.11 IC28.11
N$298
  Bottom 0.406: IC25.12 IC26.12 IC27.12 IC28.12
N$299
  Bottom 0.406: IC25.13 IC26.13 IC27.13 IC28.13
N$300
  Bottom 0.406: IC25.14 IC26.14 IC27.14 IC28.14
N$301
  Bottom 0.406: IC25.15 IC26.15 IC27.15 IC28.15
N$302
  Bottom 0.406: IC25.16 IC26.16 IC27.16 IC28.16
N$303
  Bottom 0.406: IC25.17 IC26.17 IC27.17 IC28.17
N$304
  Bottom 0.406: IC25.18 IC26.18 IC27.18 IC28.18
N$305
  Bottom 0.406: IC25.19 IC26.19 IC27.19 IC28.19
N$306
  Bottom 0.406: IC25.20 IC26.20 IC27.20 IC28.20
N$307
  Bottom 0.406: IC25.21 IC26.21 IC27.21 IC28.21
N$308
  Bottom 0.406: IC25.22 IC26.22 IC27.22 IC28.22
N$309
  Bottom 0.406: IC25.23 IC26.23 IC27.23 IC28.23
N$310
  Bottom 0.406: IC25.24 IC26.24 IC27.24 IC28.24
N$311
  Bottom 0.406: IC25.25 IC26.25 IC27.25 IC28.25
N$312
  Bottom 0.406: IC25.26 IC26.26 IC27.26 IC28.26
N$313
  Bottom 0.406: IC25.27 IC26.27 IC27.27 IC28.27
N$314
  Bottom 0.406: IC25.28 IC26.28 IC27.28 IC28.28
N$315
  Bottom 0.406: IC25.29 IC26.29 IC27.29 IC28.29
N$316
  Bottom 0.406: IC25.30 IC26.30 IC27.30 IC28.30
N$317
  Bottom 0.406: IC25.31 IC26.31 IC27.31 IC28.31
N$318
  Bottom 0.406: IC25.32 IC26.32 IC27.32 IC28.32
N$319
  Bottom 0.406: IC25.33 IC26.33 IC27.33 IC28.33
N$320
  Bottom 0.406: IC25.34 IC26.34 IC27.34 IC28.34
N$321
  Bottom 0.406: IC25.35 IC26.35 IC27.35 IC28.35
N$322
  Bottom 0.406: IC25.36 IC26.36 IC27.36 IC28.36
N$323
  Bottom 0.406: IC25.37 IC26.37 IC27.37 IC28.37
N$324
  Bottom 0.406: IC25.38 IC26.38 IC27.38 IC28.38
N$325
  Bottom 0.406: IC25.39 IC26.39 IC27.39 IC28.39
N$326
  Bottom 0.406: IC25.40 IC26.40 IC27.40 IC28.40
N$327
  Bottom 0.406: IC25.41 IC26.41 IC27.41 IC28.41
N$328
  Bottom 0.406: IC25.42 IC26.42 IC27.42 IC28.42
N$329
  Bottom 0.406: IC29.1 IC30.1 IC31.1 IC32.1
N$330
  Bottom 0.406: IC29.2 IC30.2 IC31.2 IC32.2
N$331
  Bottom 0.406: IC29.3 IC30.3 IC31.3 IC32.3
N$332
  Bottom 0.406: IC29.4 IC30.4 IC31.4 IC32.4
N$333
  Bottom 0.406: IC29.5 IC30.5 IC31.5 IC32.5
N$334
  Bottom 0.406: IC29.6 IC30.6 IC31.6 IC32.6
N$335
  Bottom 0.406: IC29.7 IC30.7 IC31.7 IC32.7
N$336
  Bottom 0.406: IC29.8 IC30.8 IC31.8 IC32.8
N$337
  Bottom 0.406: IC29.9 IC30.9 IC31.9 IC32.9
N$338
  Bottom 0.406: IC29.10 IC30.10 IC31.10 IC32.10
N$339
  Bottom 0.406: IC29.11 IC30.11 IC31.11 IC32.11
N$340
  Bottom 0.406: IC29.12 IC30.12 IC31.12 IC32.12
N$341
  Bottom 0.406: IC29.13 IC30.13 IC31.13 IC32.13
N$342
  Bottom 0.406: IC29.14 IC30.14 IC31.14 IC32.14
N$343
  Bottom 0.406: IC29.15 IC30.15 IC31.15 IC32.15
N$344
  Bottom 0.406: IC29.16 IC30.16 IC31.16 IC32.16
N$345
  Bottom 0.406: IC29.17 IC30.17 IC31.17 IC32.17
N$346
  Bottom 0.406: IC29.18 IC30.18 IC31.18 IC32.18
N$347
  Bottom 0.406: IC29.19 IC30.19 IC31.19 IC32.19
N$348
  Bottom 0.406: IC29.20 IC30.20 IC31.20 IC32.20
N$349
  Bottom 0.406: IC29.21 IC30.21 IC31.21 IC32.21
N$350
  Bottom 0.406: IC29.22 IC30.22 IC31.22 IC32.22
N$351
  Bottom 0.406: IC29.23 IC30.23 IC31.23 IC32.23
N$352
  Bottom 0.406: IC29.24 IC30.24 IC31.24 IC32.24
N$353
  Bottom 0.406: IC29.25 IC30.25 IC31.25 IC32.25
N$354
  Bottom 0.406: IC29.26 IC30.26 IC31.26 IC32.26
N$355
  Bottom 0.406: IC29.27 IC30.27 IC31.27 IC32.27
N$356
  Bottom 0.406: IC29.28 IC30.28 IC31.28 IC32.28
N$357
  Bottom 0.406: IC29.29 IC30.29 IC31.29 IC32.29
N$358
  Bottom 0.406: IC29.30 IC30.30 IC31.30 IC32.30
N$359
  Bottom 0.406: IC29.31 IC30.31 IC31.31 IC32.31
N$360
  Bottom 0.406: IC29.32 IC30.32 IC31.32 IC32.32
N$361
  Bottom 0.406: IC29.33 IC30.33 IC31.33 IC32.33
N$362
  Bottom 0.406: IC29.34 IC30.34 IC31.34 IC32.34
N$363
  Bottom 0.406: IC29.35 IC30.35 IC31.35 IC32.35
N$364
  Bottom 0.406: IC29.36 IC30.36 IC31.36 IC32.36
N$365
  Bottom 0.406: IC29.37 IC30.37 IC31.37 IC32.37
N$366
  Bottom 0.406: IC29.38 IC30.38 IC31.38 IC32.38
N$367
  Bottom 0.406: IC29.39 IC30.39 IC31.39 IC32.39
N$368
  Bottom 0.406: IC29.40 IC30.40 IC31.40 IC32.40
N$369
  Bottom 0.406: IC29.41 IC30.41 IC31.41 IC32.41
N$370
  Bottom 0.406: IC29.42 IC30.42 IC31.42 IC32.42
N$371
  Bottom 0.406: IC33.1 IC34.1 IC35.1 IC36.1
N$372
  Bottom 0.406: IC33.2 IC34.2 IC35.2 IC36.2
N$373
  Top 0.406: U$6.18 138.3,17.78 138.3,15.24 137.03,13.97 U$1.BV1
N$374
  Top 0.406: U$6.17 141.48,17.78 141.48,15.24 140.21,13.97 U$1.BU1
N$375
  Top 0.406: U$6.16 144.65,17.78 144.65,15.24 143.38,13.97 U$1.BT1
N$376
  Top 0.406: U$6.15 147.83,17.78 147.83,15.24 146.56,13.97 U$1.BS1
N$377
  Top 0.406: U$6.14 151,17.78 151,15.24 149.73,13.97 U$1.BR1
N$378
  Top 0.406: U$6.13 154.18,17.78 154.18,15.24 152.91,13.97 U$1.BP1
N$379
  Top 0.406: U$6.12 157.35,17.78 157.35,15.24 156.08,13.97 U$1.BN1
N$380
  Top 0.406: U$6.11 160.53,17.78 160.53,15.24 159.26,13.97 U$1.BM1
N$381
  Top 0.406: U$6.10 163.7,17.78 163.7,15.24 162.43,13.97 U$1.BL1
N$382
  Top 0.406: U$6.9 166.88,17.78 166.88,15.24 165.61,13.97 U$1.BK1
N$383
  Top 0.406: U$6.8 170.05,17.78 170.05,15.24 168.78,13.97 U$1.BJ1
N$384
  Top 0.406: U$6.7 173.23,17.78 173.23,15.24 171.96,13.97 U$1.BH1
N$385
  Top 0.406: U$6.6 176.4,17.78 176.4,15.24 175.13,13.97 U$1.BF1
N$386
  Top 0.406: U$6.5 179.58,17.78 179.58,15.24 178.31,13.97 U$1.BE1
N$387
  Top 0.406: U$6.4 182.75,17.78 182.75,15.24 181.48,13.97 U$1.BD1
N$388
  Top 0.406: U$6.3 185.93,17.78 185.93,15.24 184.66,13.97 U$1.BC1
N$389
  Top 0.406: U$6.2 189.1,17.78 189.1,15.24 187.83,13.97 U$1.BB1
N$390
  Top 0.406: U$6.1 191.64,17.78 191.64,13.97 U$1.BA1
N$391
  Bottom 0.406: U$7.18 137.03,21.59 137.03,13.97 U$1.BV2
N$392
  Bottom 0.406: U$7.17 140.21,21.59 140.21,13.97 U$1.BU2
N$393
  Bottom 0.406: U$7.16 143.38,21.59 143.38,13.97 U$1.BT2
N$394
  Bottom 0.406: U$7.15 146.56,21.59 146.56,13.97 U$1.BS2
N$395
  Bottom 0.406: U$7.14 149.73,21.59 149.73,13.97 U$1.BR2
N$396
  Bottom 0.406: U$7.13 152.91,21.59 152.91,13.97 U$1.BP2
N$397
  Bottom 0.406: U$7.12 156.08,21.59 156.08,13.97 U$1.BN2
N$398
  Bottom 0.406: U$7.11 159.26,21.59 159.26,13.97 U$1.BM2
N$399
  Bottom 0.406: U$7.10 162.43,21.59 162.43,13.97 U$1.BL2
N$400
  Bottom 0.406: U$7.9 165.61,21.59 165.61,13.97 U$1.BK2
N$401
  Bottom 0.406: U$7.8 168.78,21.59 168.78,13.97 U$1.BJ2
N$402
  Bottom 0.406: U$7.7 171.96,21.59 171.96,13.97 U$1.BH2
N$403
  Bottom 0.406: U$7.6 175.13,21.59 175.13,13.97 U$1.BF2
N$404
  Bottom 0.406: U$7.5 178.31,21.59 178.31,13.97 U$1.BE2
N$405
  Bottom 0.406: U$7.4 181.48,21.59 181.48,13.97 U$1.BD2
N$406
  Bottom 0.406: U$7.3 184.66,21.59 184.66,13.97 U$1.BC2
N$407
  Bottom 0.406: U$7.2 187.83,21.59 187.83,13.97 U$1.BB2
N$408
  Bottom 0.406: U$7.1 191.01,21.59 191.01,13.97 U$1.BA2
N$409
  Top 0.406: U$9.18 74.8,17.78 74.8,15.24 73.53,13.97 U$1.CV1
N$410
  Top 0.406: U$9.17 77.98,17.78 77.98,15.24 76.71,13.97 U$1.CU1
N$411
  Top 0.406: U$9.16 81.15,17.78 81.15,15.24 79.88,13.97 U$1.CT1
N$412
  Top 0.406: U$9.15 84.33,17.78 84.33,15.24 83.06,13.97 U$1.CS1
N$413
  Top 0.406: U$9.14 87.5,17.78 87.5,15.24 86.23,13.97 U$1.CR1
N$414
  Top 0.406: U$9.13 90.68,17.78 90.68,15.24 89.41,13.97 U$1.CP1
N$415
  Top 0.406: U$9.12 93.85,17.78 93.85,15.24 92.58,13.97 U$1.CN1
N$416
  Top 0.406: U$9.11 97.03,17.78 97.03,15.24 95.76,13.97 U$1.CM1
N$417
  Top 0.406: U$9.10 100.2,17.78 100.2,15.24 98.93,13.97 U$1.CL1
N$418
  Top 0.406: U$9.9 103.38,17.78 103.38,15.24 102.11,13.97 U$1.CK1
N$419
  Top 0.406: U$9.8 106.55,17.78 106.55,15.24 105.28,13.97 U$1.CJ1
N$420
  Top 0.406: U$9.7 109.73,17.78 109.73,15.24 108.46,13.97 U$1.CH1
N$421
  Top 0.406: U$9.6 112.9,17.78 112.9,15.24 111.63,13.97 U$1.CF1
N$422
  Top 0.406: U$9.5 116.08,17.78 116.08,15.24 114.81,13.97 U$1.CE1
N$423
  Top 0.406: U$9.4 119.25,17.78 119.25,15.24 117.98,13.97 U$1.CD1
N$424
  Top 0.406: U$9.3 122.43,17.78 122.43,15.24 121.16,13.97 U$1.CC1
N$425
  Top 0.406: U$9.2 125.6,17.78 125.6,15.24 124.33,13.97 U$1.CB1
N$426
  Top 0.406: U$9.1 128.14,17.78 128.14,13.97 U$1.CA1
N$427
  Bottom 0.406: U$10.18 73.53,21.59 73.53,13.97 U$1.CV2
N$428
  Bottom 0.406: U$10.17 76.71,21.59 76.71,13.97 U$1.CU2
N$429
  Bottom 0.406: U$10.16 79.88,21.59 79.88,13.97 U$1.CT2
N$430
  Bottom 0.406: U$10.15 83.06,21.59 83.06,13.97 U$1.CS2
N$431
  Bottom 0.406: U$10.14 86.23,21.59 86.23,13.97 U$1.CR2
N$432
  Bottom 0.406: U$10.13 89.41,21.59 89.41,13.97 U$1.CP2
N$433
  Bottom 0.406: U$10.12 92.58,21.59 92.58,13.97 U$1.CN2
N$434
  Bottom 0.406: U$10.11 95.76,21.59 95.76,13.97 U$1.CM2
N$435
  Bottom 0.406: U$10.10 98.93,21.59 98.93,13.97 U$1.CL2
N$436
  Bottom 0.406: U$10.9 102.11,21.59 102.11,13.97 U$1.CK2
N$437
  Bottom 0.406: U$10.8 105.28,21.59 105.28,13.97 U$1.CJ2
N$438
  Bottom 0.406: U$10.7 108.46,21.59 108.46,13.97 U$1.CH2
N$439
  Bottom 0.406: U$10.6 111.63,21.59 111.63,13.97 U$1.CF2
N$440
  Bottom 0.406: U$10.5 114.81,21.59 114.81,13.97 U$1.CE2
N$441
  Bottom 0.406: U$10.4 117.98,21.59 117.98,13.97 U$1.CD2
N$442
  Bottom 0.406: U$10.3 121.16,21.59 121.16,13.97 U$1.CC2
N$443
  Bottom 0.406: U$10.2 124.33,21.59 124.33,13.97 U$1.CB2
N$444
  Bottom 0.406: U$10.1 127.51,21.59 127.51,13.97 U$1.CA2
N$445
  Top 0.406: U$11.18 4.95,17.78 4.95,15.24 3.68,13.97 U$1.DV1
N$446
  Top 0.406: U$11.17 8.13,17.78 8.13,15.24 6.86,13.97 U$1.DU1
N$447
  Top 0.406: U$11.16 11.3,17.78 11.3,15.24 10.03,13.97 U$1.DT1
N$448
  Top 0.406: U$11.15 14.48,17.78 14.48,15.24 13.21,13.97 U$1.DS1
N$449
  Top 0.406: U$11.14 17.65,17.78 17.65,15.24 16.38,13.97 U$1.DR1
N$450
  Top 0.406: U$11.13 20.83,17.78 20.83,15.24 19.56,13.97 U$1.DP1
N$451
  Top 0.406: U$11.12 24,17.78 24,15.24 22.73,13.97 U$1.DN1
N$452
  Top 0.406: U$11.11 27.18,17.78 27.18,15.24 25.91,13.97 U$1.DM1
N$453
  Top 0.406: U$11.10 30.35,17.78 30.35,15.24 29.08,13.97 U$1.DL1
N$454
  Top 0.406: U$11.9 33.53,17.78 33.53,15.24 32.26,13.97 U$1.DK1
N$455
  Top 0.406: U$11.8 36.7,17.78 36.7,15.24 35.43,13.97 U$1.DJ1
N$456
  Top 0.406: U$11.7 39.88,17.78 39.88,15.24 38.61,13.97 U$1.DH1
N$457
  Top 0.406: U$11.6 43.05,17.78 43.05,15.24 41.78,13.97 U$1.DF1
N$458
  Top 0.406: U$11.5 46.23,17.78 46.23,15.24 44.96,13.97 U$1.DE1
N$459
  Top 0.406: U$11.4 49.4,17.78 49.4,15.24 48.13,13.97 U$1.DD1
N$460
  Top 0.406: U$11.3 52.58,17.78 52.58,15.24 51.31,13.97 U$1.DC1
N$461
  Top 0.406: U$11.2 55.75,17.78 55.75,15.24 54.48,13.97 U$1.DB1
N$462
  Top 0.406: U$11.1 58.29,17.78 58.29,13.97 U$1.DA1
N$463
  Bottom 0.406: U$12.18 3.68,21.59 3.68,13.97 U$1.DV2
N$464
  Bottom 0.406: U$12.17 6.86,21.59 6.86,13.97 U$1.DU2
N$465
  Bottom 0.406: U$12.16 10.03,21.59 10.03,13.97 U$1.DT2
N$466
  Bottom 0.406: U$12.15 13.21,21.59 13.21,13.97 U$1.DS2
N$467
  Bottom 0.406: U$12.14 16.38,21.59 16.38,13.97 U$1.DR2
N$468
  Bottom 0.406: U$12.13 19.56,21.59 19.56,13.97 U$1.DP2
N$469
  Bottom 0.406: U$12.12 22.73,21.59 22.73,13.97 U$1.DN2
N$470
  Bottom 0.406: U$12.11 25.91,21.59 25.91,13.97 U$1.DM2
N$471
  Bottom 0.406: U$12.10 29.08,21.59 29.08,13.97 U$1.DL2
N$472
  Bottom 0.406: U$12.9 32.26,21.59 32.26,13.97 U$1.DK2
N$473
  Bottom 0.406: U$12.8 35.43,21.59 35.43,13.97 U$1.DJ2
N$474
  Bottom 0.406: U$12.7 38.61,21.59 38.61,13.97 U$1.DH2
N$475
  Bottom 0.406: U$12.6 41.78,21.59 41.78,13.97 U$1.DF2
N$476
  Bottom 0.406: U$12.5 44.96,21.59 44.96,13.97 U$1.DE2
N$477
  Bottom 0.406: U$12.4 48.13,21.59 48.13,13.97 U$1.DD2
N$478
  Bottom 0.406: U$12.3 51.31,21.59 51.31,13.97 U$1.DC2
N$479
  Bottom 0.406: U$12.2 54.48,21.59 54.48,13.97 U$1.DB2
N$480
  Bottom 0.406: U$12.1 57.66,21.59 57.66,13.97 U$1.DA2
N$481
  Bottom 0.406: IC33.3 IC34.3 IC35.3 IC36.3
N$482
  Bottom 0.406: IC33.4 IC34.4 IC35.4 IC36.4
N$483
  Bottom 0.406: IC33.5 IC34.5 IC35.5 IC36.5
N$484
  Bottom 0.406: IC33.6 IC34.6 IC35.6 IC36.6
N$485
  Bottom 0.406: IC33.7 IC34.7 IC35.7 IC36.7
N$486
  Bottom 0.406: IC33.8 IC34.8 IC35.8 IC36.8
N$487
  Bottom 0.406: IC33.9 IC34.9 IC35.9 IC36.9
N$488
  Bottom 0.406: IC33.10 IC34.10 IC35.10 IC36.10
N$489
  Bottom 0.406: IC33.11 IC34.11 IC35.11 IC36.11
N$490
  Bottom 0.406: IC33.12 IC34.12 IC35.12 IC36.12
N$491
  Bottom 0.406: IC33.13 IC34.13 IC35.13 IC36.13
N$492
  Bottom 0.406: IC33.14 IC34.14 IC35.14 IC36.14
N$493
  Bottom 0.406: IC33.15 IC34.15 IC35.15 IC36.15
N$494
  Bottom 0.406: IC33.16 IC34.16 IC35.16 IC36.16
N$495
  Bottom 0.406: IC33.17 IC34.17 IC35.17 IC36.17
N$496
  Bottom 0.406: IC33.18 IC34.18 IC35.18 IC36.18
N$497
  Bottom 0.406: IC33.19 IC34.19 IC35.19 IC36.19
N$498
  Bottom 0.406: IC33.20 IC34.20 IC35.20 IC36.20
N$499
  Bottom 0.406: IC33.21 IC34.21 IC35.21 IC36.21
N$500
  Bottom 0.406: IC33.22 IC34.22 IC35.22 IC36.22
N$501
  Bottom 0.406: IC33.23 IC34.23 IC35.23 IC36.23
N$502
  Bottom 0.406: IC33.24 IC34.24 IC35.24 IC36.24
N$503
  Bottom 0.406: IC33.25 IC34.25 IC35.25 IC36.25
N$504
  Bottom 0.406: IC33.26 IC34.26 IC35.26 IC36.26
N$505
  Bottom 0.406: IC33.27 IC34.27 IC35.27 IC36.27
N$506
  Bottom 0.406: IC33.28 IC34.28 IC35.28 IC36.28
N$507
  Bottom 0.406: IC33.29 IC34.29 IC35.29 IC36.29
N$508
  Bottom 0.406: IC33.30 IC34.30 IC35.30 IC36.30
N$509
  Bottom 0.406: IC33.31 IC34.31 IC35.31 IC36.31
N$510
  Bottom 0.406: IC33.32 IC34.32 IC35.32 IC36.32
N$511
  Bottom 0.406: IC33.33 IC34.33 IC35.33 IC36.33
N$512
  Bottom 0.406: IC33.34 IC34.34 IC35.34 IC36.34
N$513
  Bottom 0.406: IC33.35 IC34.35 IC35.35 IC36.35
N$514
  Bottom 0.406: IC33.36 IC34.36 IC35.36 IC36.36
N$515
  Bottom 0.406: IC33.37 IC34.37 IC35.37 IC36.37
N$516
  Bottom 0.406: IC33.38 IC34.38 IC35.38 IC36.38
N$517
  Bottom 0.406: IC33.39 IC34.39 IC35.39 IC36.39
N$518
  Bottom 0.406: IC33.40 IC34.40 IC35.40 IC36.40
N$519
  Bottom 0.406: IC33.41 IC34.41 IC35.41 IC36.41
N$520
  Bottom 0.406: IC33.42 IC34.42 IC35.42 IC36.42
N$521
  Bottom 0.406: IC37.1 IC38.1 IC39.1 IC40.1
N$522
  Bottom 0.406: IC37.2 IC38.2 IC39.2 IC40.2
N$523
  Bottom 0.406: IC37.3 IC38.3 IC39.3 IC40.3
N$524
  Bottom 0.406: IC37.4 IC38.4 IC39.4 IC40.4
N$525
  Bottom 0.406: IC37.5 IC38.5 IC39.5 IC40.5
N$526
  Bottom 0.406: IC37.6 IC38.6 IC39.6 IC40.6
N$527
  Bottom 0.406: IC37.7 IC38.7 IC39.7 IC40.7
N$528
  Bottom 0.406: IC37.8 IC38.8 IC39.8 IC40.8
N$529
  Bottom 0.406: IC37.9 IC38.9 IC39.9 IC40.9
N$530
  Bottom 0.406: IC37.10 IC38.10 IC39.10 IC40.10
N$531
  Bottom 0.406: IC37.11 IC38.11 IC39.11 IC40.11
N$532
  Bottom 0.406: IC37.12 IC38.12 IC39.12 IC40.12
N$533
  Bottom 0.406: IC37.13 IC38.13 IC39.13 IC40.13
N$534
  Bottom 0.406: IC37.14 IC38.14 IC39.14 IC40.14
N$535
  Bottom 0.406: IC37.15 IC38.15 IC39.15 IC40.15
N$536
  Bottom 0.406: IC37.16 IC38.16 IC39.16 IC40.16
N$537
  Bottom 0.406: IC37.17 IC38.17 IC39.17 IC40.17
N$538
  Bottom 0.406: IC37.18 IC38.18 IC39.18 IC40.18
N$539
  Bottom 0.406: IC37.19 IC38.19 IC39.19 IC40.19
N$540
  Bottom 0.406: IC37.20 IC38.20 IC39.20 IC40.20
N$541
  Bottom 0.406: IC37.21 IC38.21 IC39.21 IC40.21
N$542
  Bottom 0.406: IC37.22 IC38.22 IC39.22 IC40.22
N$543
  Bottom 0.406: IC37.23 IC38.23 IC39.23 IC40.23
N$544
  Bottom 0.406: IC37.24 IC38.24 IC39.24 IC40.24
N$545
  Bottom 0.406: IC37.25 IC38.25 IC39.25 IC40.25
N$546
  Bottom 0.406: IC37.26 IC38.26 IC39.26 IC40.26
N$547
  Bottom 0.406: IC37.27 IC38.27 IC39.27 IC40.27
N$548
  Bottom 0.406: IC37.28 IC38.28 IC39.28 IC40.28
N$549
  Bottom 0.406: IC37.29 IC38.29 IC39.29 IC40.29
N$550
  Bottom 0.406: IC37.30 IC38.30 IC39.30 IC40.30
N$551
  Bottom 0.406: IC37.31 IC38.31 IC39.31 IC40.31
N$552
  Bottom 0.406: IC37.32 IC38.32 IC39.32 IC40.32
N$553
  Bottom 0.406: IC37.33 IC38.33 IC39.33 IC40.33
N$554
  Bottom 0.406: IC37.34 IC38.34 IC39.34 IC40.34
N$555
  Bottom 0.406: IC37.35 IC38.35 IC39.35 IC40.35
N$556
  Bottom 0.406: IC37.36 IC38.36 IC39.36 IC40.36
N$557
  Bottom 0.406: IC37.37 IC38.37 IC39.37 IC40.37
N$558
  Bottom 0.406: IC37.38 IC38.38 IC39.38 IC40.38
N$559
  Bottom 0.406: IC37.39 IC38.39 IC39.39 IC40.39
N$560
  Bottom 0.406: IC37.40 IC38.40 IC39.40 IC40.40
N$561
  Bottom 0.406: IC37.41 IC38.41 IC39.41 IC40.41
N$562
  Bottom 0.406: IC37.42 IC38.42 IC39.42 IC40.42
N$563
  Bottom 0.406: IC41.1 IC42.1 IC43.1 IC44.1
N$564
  Bottom 0.406: IC41.2 IC42.2 IC43.2 IC44.2
N$565
  Bottom 0.406: IC41.3 IC42.3 IC43.3 IC44.3
N$566
  Bottom 0.406: IC41.4 IC42.4 IC43.4 IC44.4
N$567
  Bottom 0.406: IC41.5 IC42.5 IC43.5 IC44.5
N$568
  Bottom 0.406: IC41.6 IC42.6 IC43.6 IC44.6
N$569
  Bottom 0.406: IC41.7 IC42.7 IC43.7 IC44.7
N$570
  Bottom 0.406: IC41.8 IC42.8 IC43.8 IC44.8
N$571
  Bottom 0.406: IC41.9 IC42.9 IC43.9 IC44.9
N$572
  Bottom 0.406: IC41.10 IC42.10 IC43.10 IC44.10
N$573
  Bottom 0.406: IC41.11 IC42.11 IC43.11 IC44.11
N$574
  Bottom 0.406: IC41.12 IC42.12 IC43.12 IC44.12
N$575
  Bottom 0.406: IC41.13 IC42.13 IC43.13 IC44.13
N$576
  Bottom 0.406: IC41.14 IC42.14 IC43.14 IC44.14
N$577
  Bottom 0.406: IC41.15 IC42.15 IC43.15 IC44.15
N$578
  Bottom 0.406: IC41.16 IC42.16 IC43.16 IC44.16
N$579
  Bottom 0.406: IC41.17 IC42.17 IC43.17 IC44.17
N$580
  Bottom 0.406: IC41.18 IC42.18 IC43.18 IC44.18
N$581
  Bottom 0.406: IC41.19 IC42.19 IC43.19 IC44.19
N$582
  Bottom 0.406: IC41.20 IC42.20 IC43.20 IC44.20
N$583
  Bottom 0.406: IC41.21 IC42.21 IC43.21 IC44.21
N$584
  Bottom 0.406: IC41.22 IC42.22 IC43.22 IC44.22
N$585
  Bottom 0.406: IC41.23 IC42.23 IC43.23 IC44.23
N$586
  Bottom 0.406: IC41.24 IC42.24 IC43.24 IC44.24
N$587
  Bottom 0.406: IC41.25 IC42.25 IC43.25 IC44.25
N$588
  Bottom 0.406: IC41.26 IC42.26 IC43.26 IC44.26
N$589
  Bottom 0.406: IC41.27 IC42.27 IC43.27 IC44.27
N$590
  Bottom 0.406: IC41.28 IC42.28 IC43.28 IC44.28
N$591
  Bottom 0.406: IC41.29 IC42.29 IC43.29 IC44.29
N$592
  Bottom 0.406: IC41.30 IC42.30 IC43.30 IC44.30
N$593
  Bottom 0.406: IC41.31 IC42.31 IC43.31 IC44.31
N$594
  Bottom 0.406: IC41.32 IC42.32 IC43.32 IC44.32
N$595
  Bottom 0.406: IC41.33 IC42.33 IC43.33 IC44.33
N$596
  Bottom 0.406: IC41.34 IC42.34 IC43.34 IC44.34
N$597
  Bottom 0.406: IC41.35 IC42.35 IC43.35 IC44.35
N$598
  Bottom 0.406: IC41.36 IC42.36 IC43.36 IC44.36
N$599
  Bottom 0.406: IC41.37 IC42.37 IC43.37 IC44.37
N$600
  Bottom 0.406: IC41.38 IC42.38 IC43.38 IC44.38
N$601
  Bottom 0.406: IC41.39 IC42.39 IC43.39 IC44.39
N$602
  Bottom 0.406: IC41.40 IC42.40 IC43.40 IC44.40
N$603
  Bottom 0.406: IC41.41 IC42.41 IC43.41 IC44.41
N$604
  Bottom 0.406: IC41.42 IC42.42 IC43.42 IC44.42
N$605
  Bottom 0.406: IC45.1 IC46.1 IC47.1 IC48.1
N$606
  Bottom 0.406: IC45.2 IC46.2 IC47.2 IC48.2
N$607
  Bottom 0.406: IC45.3 IC46.3 IC47.3 IC48.3
N$608
  Bottom 0.406: IC45.4 IC46.4 IC47.4 IC48.4
N$609
  Bottom 0.406: IC45.5 IC46.5 IC47.5 IC48.5
N$610
  Bottom 0.406: IC45.6 IC46.6 IC47.6 IC48.6
N$611
  Bottom 0.406: IC45.7 IC46.7 IC47.7 IC48.7
N$612
  Bottom 0.406: IC45.8 IC46.8 IC47.8 IC48.8
N$613
  Bottom 0.406: IC45.9 IC46.9 IC47.9 IC48.9
N$614
  Bottom 0.406: IC45.10 IC46.10 IC47.10 IC48.10
N$615
  Bottom 0.406: IC45.11 IC46.11 IC47.11 IC48.11
N$616
  Bottom 0.406: IC45.12 IC46.12 IC47.12 IC48.12
N$617
  Bottom 0.406: IC45.13 IC46.13 IC47.13 IC48.13
N$618
  Bottom 0.406: IC45.14 IC46.14 IC47.14 IC48.14
N$619
  Bottom 0.406: IC45.15 IC46.15 IC47.15 IC48.15
N$620
  Bottom 0.406: IC45.16 IC46.16 IC47.16 IC48.16
N$621
  Bottom 0.406: IC45.17 IC46.17 IC47.17 IC48.17
N$622
  Bottom 0.406: IC45.18 IC46.18 IC47.18 IC48.18
N$623
  Bottom 0.406: IC45.19 IC46.19 IC47.19 IC48.19
N$624
  Bottom 0.406: IC45.20 IC46.20 IC47.20 IC48.20
N$625
  Bottom 0.406: IC45.21 IC46.21 IC47.21 IC48.21
N$626
  Bottom 0.406: IC45.22 IC46.22 IC47.22 IC48.22
N$627
  Bottom 0.406: IC45.23 IC46.23 IC47.23 IC48.23
N$628
  Bottom 0.406: IC45.24 IC46.24 IC47.24 IC48.24
N$629
  Bottom 0.406: IC45.25 IC46.25 IC47.25 IC48.25
N$630
  Bottom 0.406: IC45.26 IC46.26 IC47.26 IC48.26
N$631
  Bottom 0.406: IC45.27 IC46.27 IC47.27 IC48.27
N$632
  Bottom 0.406: IC45.28 IC46.28 IC47.28 IC48.28
N$633
  Bottom 0.406: IC45.29 IC46.29 IC47.29 IC48.29
N$634
  Bottom 0.406: IC45.30 IC46.30 IC47.30 IC48.30
N$635
  Bottom 0.406: IC45.31 IC46.31 IC47.31 IC48.31
N$636
  Bottom 0.406: IC45.32 IC46.32 IC47.32 IC48.32
N$637
  Bottom 0.406: IC45.33 IC46.33 IC47.33 IC48.33
N$638
  Bottom 0.406: IC45.34 IC46.34 IC47.34 IC48.34
N$639
  Bottom 0.406: IC45.35 IC46.35 IC47.35 IC48.35
N$640
  Bottom 0.406: IC45.36 IC46.36 IC47.36 IC48.36
N$641
  Bottom 0.406: IC45.37 IC46.37 IC47.37 IC48.37
N$642
  Bottom 0.406: IC45.38 IC46.38 IC47.38 IC48.38
N$643
  Bottom 0.406: IC45.39 IC46.39 IC47.39 IC48.39
N$644
  Bottom 0.406: IC45.40 IC46.40 IC47.40 IC48.40
N$645
  Bottom 0.406: IC45.41 IC46.41 IC47.41 IC48.41
N$646
  Bottom 0.406: IC45.42 IC46.42 IC47.42 IC48.42
N$647
  Bottom 0.406: IC49.1 IC50.1 IC51.1 IC52.1
N$648
  Bottom 0.406: IC49.2 IC50.2 IC51.2 IC52.2
N$649
  Bottom 0.406: IC49.3 IC50.3 IC51.3 IC52.3
N$650
  Bottom 0.406: IC49.4 IC50.4 IC51.4 IC52.4
N$651
  Bottom 0.406: IC49.5 IC50.5 IC51.5 IC52.5
N$652
  Bottom 0.406: IC49.6 IC50.6 IC51.6 IC52.6
N$653
  Bottom 0.406: IC49.7 IC50.7 IC51.7 IC52.7
N$654
  Bottom 0.406: IC49.8 IC50.8 IC51.8 IC52.8
N$655
  Bottom 0.406: IC49.9 IC50.9 IC51.9 IC52.9
N$656
  Bottom 0.406: IC49.10 IC50.10 IC51.10 IC52.10
N$657
  Bottom 0.406: IC49.11 IC50.11 IC51.11 IC52.11
N$658
  Bottom 0.406: IC49.12 IC50.12 IC51.12 IC52.12
N$659
  Bottom 0.406: IC49.13 IC50.13 IC51.13 IC52.13
N$660
  Bottom 0.406: IC49.14 IC50.14 IC51.14 IC52.14
N$661
  Bottom 0.406: IC49.15 IC50.15 IC51.15 IC52.15
N$662
  Bottom 0.406: IC49.16 IC50.16 IC51.16 IC52.16
N$663
  Bottom 0.406: IC49.17 IC50.17 IC51.17 IC52.17
N$664
  Bottom 0.406: IC49.18 IC50.18 IC51.18 IC52.18
N$665
  Bottom 0.406: IC49.19 IC50.19 IC51.19 IC52.19
N$666
  Bottom 0.406: IC49.20 IC50.20 IC51.20 IC52.20
N$667
  Bottom 0.406: IC49.21 IC50.21 IC51.21 IC52.21
N$668
  Bottom 0.406: IC49.22 IC50.22 IC51.22 IC52.22
N$669
  Bottom 0.406: IC49.23 IC50.23 IC51.23 IC52.23
N$670
  Bottom 0.406: IC49.24 IC50.24 IC51.24 IC52.24
N$671
  Bottom 0.406: IC49.25 IC50.25 IC51.25 IC52.25
N$672
  Bottom 0.406: IC49.26 IC50.26 IC51.26 IC52.26
N$673
  Bottom 0.406: IC49.27 IC50.27 IC51.27 IC52.27
N$674
  Bottom 0.406: IC49.28 IC50.28 IC51.28 IC52.28
N$675
  Bottom 0.406: IC49.29 IC50.29 IC51.29 IC52.29
N$676
  Bottom 0.406: IC49.30 IC50.30 IC51.30 IC52.30
N$677
  Bottom 0.406: IC49.31 IC50.31 IC51.31 IC52.31
N$678
  Bottom 0.406: IC49.32 IC50.32 IC51.32 IC52.32
N$679
  Bottom 0.406: IC49.33 IC50.33 IC51.33 IC52.33
N$680
  Bottom 0.406: IC49.34 IC50.34 IC51.34 IC52.34
N$681
  Bottom 0.406: IC49.35 IC50.35 IC51.35 IC52.35
N$682
  Bottom 0.406: IC49.36 IC50.36 IC51.36 IC52.36
N$683
  Bottom 0.406: IC49.37 IC50.37 IC51.37 IC52.37
N$684
  Bottom 0.406: IC49.38 IC50.38 IC51.38 IC52.38
N$685
  Bottom 0.406: IC49.39 IC50.39 IC51.39 IC52.39
N$686
  Bottom 0.406: IC49.40 IC50.40 IC51.40 IC52.40
N$687
  Bottom 0.406: IC49.41 IC50.41 IC51.41 IC52.41
N$688
  Bottom 0.406: IC49.42 IC50.42 IC51.42 IC52.42
N$689
  Bottom 0.406: IC53.1 IC54.1 IC55.1 IC56.1
N$690
  Bottom 0.406: IC53.2 IC54.2 IC55.2 IC56.2
N$691
  Bottom 0.406: IC53.3 IC54.3 IC55.3 IC56.3
N$692
  Bottom 0.406: IC53.4 IC54.4 IC55.4 IC56.4
N$693
  Bottom 0.406: IC53.5 IC54.5 IC55.5 IC56.5
N$694
  Bottom 0.406: IC53.6 IC54.6 IC55.6 IC56.6
N$695
  Bottom 0.406: IC53.7 IC54.7 IC55.7 IC56.7
N$696
  Bottom 0.406: IC53.8 IC54.8 IC55.8 IC56.8
N$697
  Bottom 0.406: IC53.9 IC54.9 IC55.9 IC56.9
N$698
  Bottom 0.406: IC53.10 IC54.10 IC55.10 IC56.10
N$699
  Bottom 0.406: IC53.11 IC54.11 IC55.11 IC56.11
N$700
  Bottom 0.406: IC53.12 IC54.12 IC55.12 IC56.12
N$701
  Bottom 0.406: IC53.13 IC54.13 IC55.13 IC56.13
N$702
  Bottom 0.406: IC53.14 IC54.14 IC55.14 IC56.14
N$703
  Bottom 0.406: IC53.15 IC54.15 IC55.15 IC56.15
N$704
  Bottom 0.406: IC53.16 IC54.16 IC55.16 IC56.16
N$705
  Bottom 0.406: IC53.17 IC54.17 IC55.17 IC56.17
N$706
  Bottom 0.406: IC53.18 IC54.18 IC55.18 IC56.18
N$707
  Bottom 0.406: IC53.19 IC54.19 IC55.19 IC56.19
N$708
  Bottom 0.406: IC53.20 IC54.20 IC55.20 IC56.20
N$709
  Bottom 0.406: IC53.21 IC54.21 IC55.21 IC56.21
N$710